# Altium project PIC32ETH.PrjPcb (part 1 of 2)
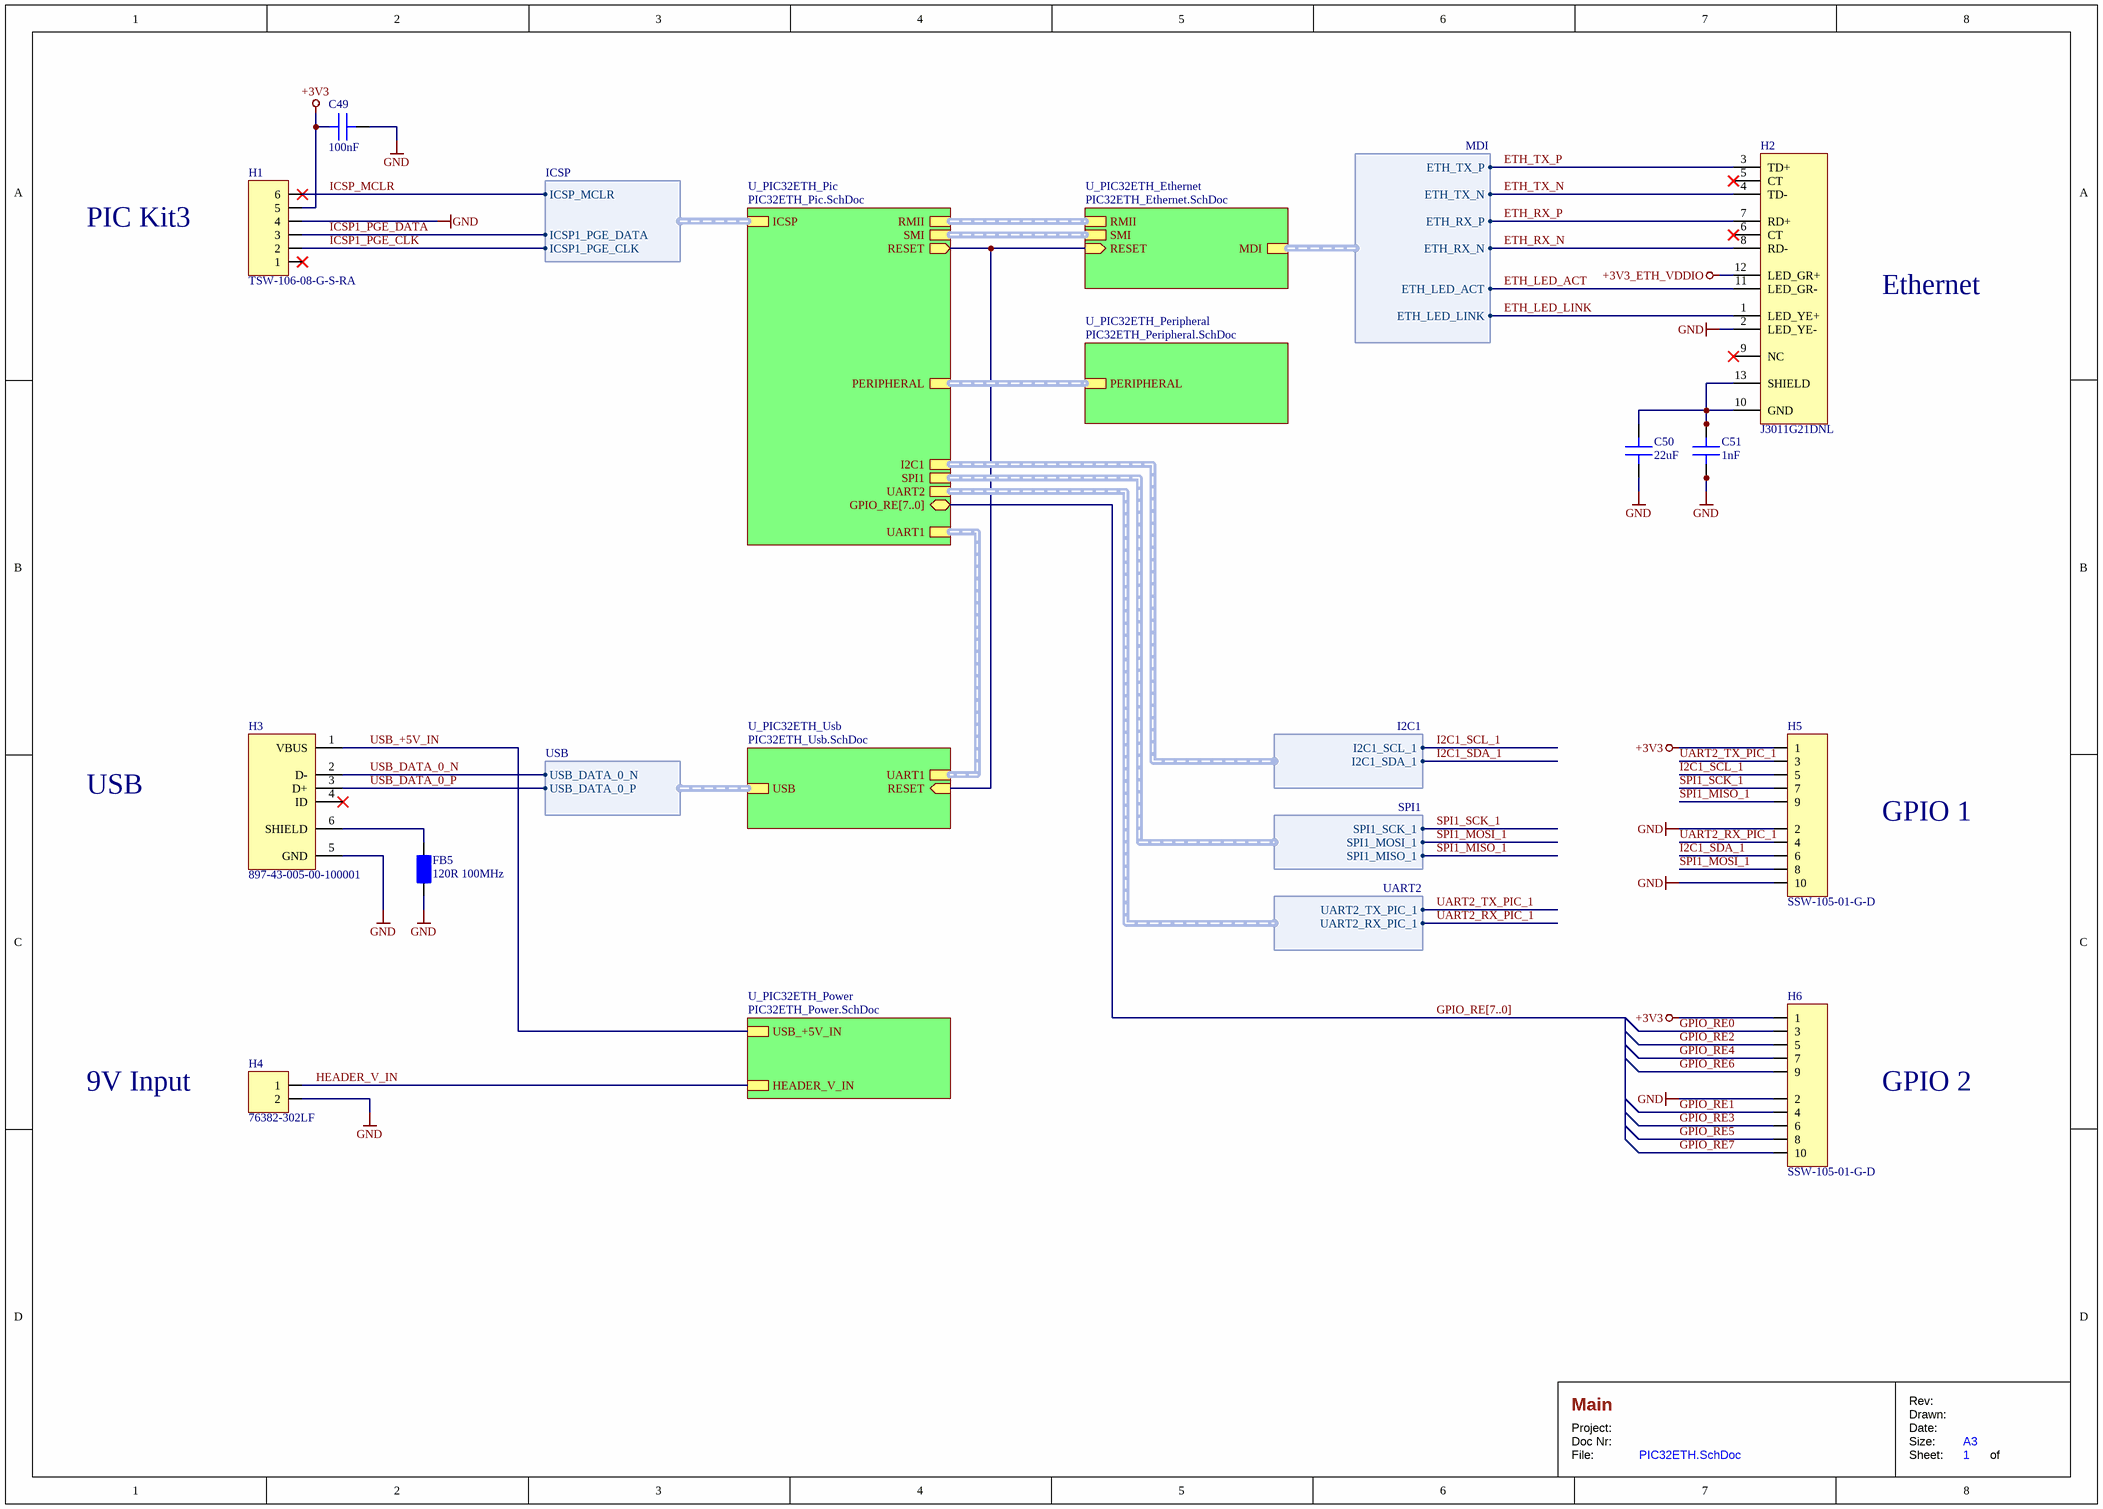
[diagram p0: PIC32ETH.SchDoc]
_Date: 08.01.2022; _DatePcb: 12.03.2022; _DocumentNumber: n/a; _DrawnBy: YS; _Project: PIC32ETH; _Revision: v1.0.0; _SheetTotal: 6
6 sheets, 161 parts. Net scope: hierarchical (ports join the sheet entries above them; power ports are global).
Board file: PIC32ETH.PcbDoc
Sheets:
  PIC32ETH.SchDoc
    U_PIC32ETH_Pic = PIC32ETH_Pic.SchDoc
    U_PIC32ETH_Ethernet = PIC32ETH_Ethernet.SchDoc
    U_PIC32ETH_Peripheral = PIC32ETH_Peripheral.SchDoc
    U_PIC32ETH_Power = PIC32ETH_Power.SchDoc
    U_PIC32ETH_Usb = PIC32ETH_Usb.SchDoc

## Sheet PIC32ETH.SchDoc: Main
size A3; Date: 08.01.2022; DrawnBy: YS; DocumentNumber: n/a; Revision: v1.0.0; SheetNumber: 1; SheetTotal: 6; Project: PIC32ETH

### Parts
C49  100nF  [C_CHIP2012N]
C50  22uF  [C_CHIP3216N]
C51  1nF  [C_CHIP2012N]
FB5  120R 100MHz  [FB_CHIP3216N]
H1  TSW-106-08-G-S-RA  [H_TSW-106-08-G-S-RA]
H2  J3011G21DNL  [H_J3011G21DNL]
H3  897-43-005-00-100001  [H_897-43-005-00-100001]
H4  76382-302LF  [H_76382-302LF]
H5  SSW-105-01-G-D  [H_SSW-105-01-G-D]
H6  SSW-105-01-G-D  [H_SSW-105-01-G-D]

### Sub-sheets
U_PIC32ETH_Ethernet = PIC32ETH_Ethernet.SchDoc: MDI (harness MDI), RMII (harness RMII), SMI (harness SMI), RESET (in)
U_PIC32ETH_Peripheral = PIC32ETH_Peripheral.SchDoc: PERIPHERAL (harness PERIPHERAL)
U_PIC32ETH_Pic = PIC32ETH_Pic.SchDoc: RMII (harness RMII), I2C1 (harness I2C1), UART2 (harness UART2), PERIPHERAL (harness PERIPHERAL), ICSP (harness ICSP), SPI1 (harness SPI1), UART1 (harness UART1), SMI (harness SMI), GPIO_RE[7..0] (bidir), RESET (out)
U_PIC32ETH_Power = PIC32ETH_Power.SchDoc: USB_+5V_IN, HEADER_V_IN
U_PIC32ETH_Usb = PIC32ETH_Usb.SchDoc: UART1 (harness UART1), USB (harness USB), RESET (in)

### Harnesses
MDI: ETH_TX_N, ETH_TX_P, ETH_RX_N, ETH_RX_P, ETH_LED_LINK, ETH_LED_ACT
UART2: UART2_RX_PIC_1, UART2_TX_PIC_1
SPI1: SPI1_MOSI_1, SPI1_SCK_1, SPI1_MISO_1
I2C1: I2C1_SDA_1, I2C1_SCL_1
ICSP: ICSP_MCLR, ICSP1_PGE_DATA, ICSP1_PGE_CLK
USB: USB_DATA_0_P, USB_DATA_0_N

### Nets
+3V3: C49.1 H1.5 H5.1 H6.1
+3V3_ETH_VDDIO: H2.12(LED_GR+)
GND: C49.2 C50.1 C51.1 FB5.2 H1.4 H2.2(LED_YE-) H3.5(GND) H4.2 H5.2 H5.10 H6.2
ETH_LED_ACT: H2.11(LED_GR-) ; sheet U_PIC32ETH_Ethernet/MDI.ETH_LED_ACT
ETH_LED_LINK: H2.1(LED_YE+) ; sheet U_PIC32ETH_Ethernet/MDI.ETH_LED_LINK
ETH_RX_N: H2.8(RD-) ; sheet U_PIC32ETH_Ethernet/MDI.ETH_RX_N
ETH_RX_P: H2.7(RD+) ; sheet U_PIC32ETH_Ethernet/MDI.ETH_RX_P
ETH_TX_N: H2.4(TD-) ; sheet U_PIC32ETH_Ethernet/MDI.ETH_TX_N
ETH_TX_P: H2.3(TD+) ; sheet U_PIC32ETH_Ethernet/MDI.ETH_TX_P
GPIO_RE0: H6.3
GPIO_RE1: H6.4
GPIO_RE2: H6.5
GPIO_RE3: H6.6
GPIO_RE4: H6.7
GPIO_RE5: H6.8
GPIO_RE6: H6.9
GPIO_RE7: H6.10
HEADER_V_IN: H4.1 ; sheet U_PIC32ETH_Power/HEADER_V_IN
I2C1_SCL_1: H5.5 ; sheet U_PIC32ETH_Pic/I2C1.I2C1_SCL_1
I2C1_SDA_1: H5.6 ; sheet U_PIC32ETH_Pic/I2C1.I2C1_SDA_1
ICSP1_PGE_CLK: H1.2 ; sheet U_PIC32ETH_Pic/ICSP.ICSP1_PGE_CLK
ICSP1_PGE_DATA: H1.3 ; sheet U_PIC32ETH_Pic/ICSP.ICSP1_PGE_DATA
ICSP_MCLR: H1.6 ; sheet U_PIC32ETH_Pic/ICSP.ICSP_MCLR
RESET: sheet U_PIC32ETH_Pic/RESET, sheet U_PIC32ETH_Ethernet/RESET, sheet U_PIC32ETH_Usb/RESET
SPI1_MISO_1: H5.9 ; sheet U_PIC32ETH_Pic/SPI1.SPI1_MISO_1
SPI1_MOSI_1: H5.8 ; sheet U_PIC32ETH_Pic/SPI1.SPI1_MOSI_1
SPI1_SCK_1: H5.7 ; sheet U_PIC32ETH_Pic/SPI1.SPI1_SCK_1
UART2_RX_PIC_1: H5.4 ; sheet U_PIC32ETH_Pic/UART2.UART2_RX_PIC_1
UART2_TX_PIC_1: H5.3 ; sheet U_PIC32ETH_Pic/UART2.UART2_TX_PIC_1
USB_+5V_IN: H3.1(VBUS) ; sheet U_PIC32ETH_Power/USB_+5V_IN
USB_DATA_0_N: H3.2(D-) ; sheet U_PIC32ETH_Usb/USB.USB_DATA_0_N
USB_DATA_0_P: H3.3(D+) ; sheet U_PIC32ETH_Usb/USB.USB_DATA_0_P
NetC50_2: C50.2 C51.2 H2.10(GND) H2.13(SHIELD)
NetFB5_1: FB5.1 H3.6(SHIELD)

Not connected (* = marked no-connect by the designer): H1 1*; H2 5(CT)* 6(CT)* 9(NC)*; H3 4(ID)*

### Buses and harness runs
bus GPIO_RE[7..0] = sheet U_PIC32ETH_Pic/GPIO_RE[7..0]
harness sheet U_PIC32ETH_Ethernet/RMII = sheet U_PIC32ETH_Pic/RMII
harness sheet U_PIC32ETH_Ethernet/SMI = sheet U_PIC32ETH_Pic/SMI
harness sheet U_PIC32ETH_Peripheral/PERIPHERAL = sheet U_PIC32ETH_Pic/PERIPHERAL
harness sheet U_PIC32ETH_Pic/UART1 = sheet U_PIC32ETH_Usb/UART1

### Notes on the sheet
- PIC Kit3
- Ethernet
- USB
- GPIO 1
- 9V Input
- GPIO 2
- Project:
- Doc Nr:
- File:
- Drawn:
- Rev:
- Date:
- Size:
- Sheet:
- A3
- of

### Library data of the parts
C49 = C_C0805C104K5RACTU: C CERAMIC 100nF 50V 10% 2012; Manufacturer: Kemet; Dielectric: X7R; Tolerance: +/-10%; Datasheet Url: https://content.kemet.com/datasheets/KEM_C1002_X7R_SMD.pdf; Mounting: SMT; Package: 2012; Part Number: C0805C104K5RACTU; Price: 0.23; Price Currency: CHF; Supplier 1: Digi-Key; Capacitance: 100nF; Voltage: 50V; Supplier Part Number 1: 399-1170-1-ND; Esr: n/a; Pin Count: 2; Temperature Range: -55degC to 125degC
C50 = C_C1206C226K8RAC7800: C CERAMIC 22uF 10V 10% 3216; Manufacturer: Kemet; Dielectric: X7R; Tolerance: +/-10%; Package: 3216; Supplier 1: Digi-Key; Part Number: C1206C226K8RAC7800; Temperature Range: -55degC to 125degC; Datasheet Url: https://api.kemet.com/component-edge/download/datasheet/C1206C226K8RAC7800.pdf; Mounting: SMT; Price: 0.65; Price Currency: CHF; Note: *; Capacitance: 22uF; Voltage: 10V; Pin Count: 2; Esr: n/a; Supplier Part Number 1: 399-11947-1-ND
C51 = C_C0805C102K5RACTU: C CERAMIC 1nF 50V 10% 2012; Manufacturer: Kemet; Dielectric: X7R; Tolerance: +/-10%; Datasheet Url: https://content.kemet.com/datasheets/KEM_C1002_X7R_SMD.pdf; Mounting: SMT; Package: 2012; Part Number: C0805C102K5RACTU; Price: 0.11; Price Currency: CHF; Supplier 1: Digi-Key; Capacitance: 1nF; Voltage: 50V; Supplier Part Number 1: 399-1147-1-ND; Esr: n/a; Pin Count: 2; Temperature Range: -55degC to 125degC
FB5 = FB_BLM31KN121SN1L: FB 120R 100MHz 6A 3216; Manufacturer: Murata Electronics; Resistance: 9mR; Datasheet Url: https://www.murata.com/en-us/products/productdata/8801529331742/ENFA0091.pdf; Mounting: SMT; Package: 3216; Part Number: BLM31KN121SN1L; Price: 0.29; Price Currency: CHF; Supplier 1: Digi-Key; Supplier Part Number 1: 490-16524-1-ND; Temperature Range: -55degC to 125degC; Pin Count: 2; Current: 6A; Impedance: 120R 100MHz
H1 = H_TSW-106-08-G-S-RA: H GENERAL HEADER 6POS 1ROW 2.54mm ANGLE THT; Manufacturer: Samtec Inc.; Current: 5.7A; Voltage: 550VAC, 770VDC; Positions: 6; Rows: 1; Datasheet URL: http://suddendocs.samtec.com/catalog_english/tsw_th.pdf; Mounting: THT; Package: n/a; Part Number: TSW-106-08-G-S-RA; Price: 0.68; Price Currency: CHF; Supplier 1: Digi-Key; Supplier Part Number 1: SAM1039-06-ND; Temperature Range: -55degC to 125degC; Pin Count: 6; Mating Cycles: n/a; Header Type: Header; Orientation: Angle; Spacing: 2.54mm
H2 = H_J3011G21DNL: H RJ45 SOCKET 1PORT ANGLE SMT; Manufacturer: Pulse; Ports: 1; Part Number: J3011G21DNL; Price Currency: CHF; Current: n/a; Datasheet URL: https://productfinder.pulseeng.com/doc_type/WEB301/doc_num/J409/doc_part/J409.pdf; Mating Cycles: n/a; Mounting: SMT; Package: n/a; Pin Count: 13; Price: 8.68; Temperature Range: 0°C to 70°C; Voltage: n/a; Header Type: Socket; Orientation: Angle; Supplier 1: Digi-Key; Supplier Part Number 1: 553-1491-ND
H3 = H_897-43-005-00-100001: H USB SOCKET 1PORT B-MINI ANGLE SMT; Manufacturer: Mill-Max Manufacturing Corp.; Mating Cycles: 5000; Current: 1A; Voltage: 30VAC; Ports: 1; Datasheet URL: http://www.farnell.com/datasheets/1734713.pdf?_ga=2.223747291.1932968036.1561574157-1154557334.1561574157&_gac=1.227804655.1561574157.CjwKCAjwr8zoBRA0EiwANmvpYNQHn877f_ACzLNOCpO9cVZHUYePGKu6J6mtcTAYQ9aGUVPIBV0ilRoC6_EQAvD_BwE; Mounting: SMT; Package: n/a; Part Number: 897-43-005-00-100001; Price: 1.21; Price Currency: CHF; Supplier 1: Digi-Key; Supplier Part Number 1: ED90341CT-ND; Pin Count: 6; Temperature Range: n/a; Header Type: Socket; Orientation: Angle; Usb Type: B-Mini
H4 = H_76382-302LF: H GENERAL HEADER 2POS 1ROW 2.54mm ANGLE THT; Manufacturer: Amphenol ICC; Current: 3A; Mating Cycles: 1000; Voltage: 1000V; Positions: 2; Rows: 1; Datasheet URL: https://cdn.amphenol-icc.com/media/wysiwyg/files/drawing/76382.pdf; Mounting: THT; Package: n/a; Part Number: 76382-302LF; Price: 0.71; Price Currency: CHF; Supplier 1: Digi-Key; Supplier Part Number 1: 609-1278-ND; Pin Count: 2; Temperature Range: -40degC to 125degC; Header Type: Header; Orientation: Angle; Spacing: 2.54mm
H5 H6 = H_SSW-105-01-G-D: H GENERAL SOCKET 10POS 2ROW 2.54mm VERTICAL THT; Manufacturer: Samtec Inc.; Current: 5.7A; Voltage: 465VAC, 655VDC; Positions: 10; Rows: 2; Datasheet URL: http://suddendocs.samtec.com/catalog_english/ssq_th.pdf; Mounting: THT; Package: n/a; Part Number: SSW-105-01-G-D; Price: 1.33; Price Currency: CHF; Supplier 1: Digi-Key; Supplier Part Number 1: SAM1208-05-ND; Temperature Range: -55degC to 125degC; Pin Count: 10; Mating Cycles: n/a; Header Type: Socket; Orientation: Vertical; Spacing: 2.54mm

## Sheet PIC32ETH_Pic.SchDoc: Pic
size A2; Date: 08.01.2022; DrawnBy: YS; DocumentNumber: n/a; Revision: v1.0.0; SheetNumber: 2; SheetTotal: 6; Project: PIC32ETH
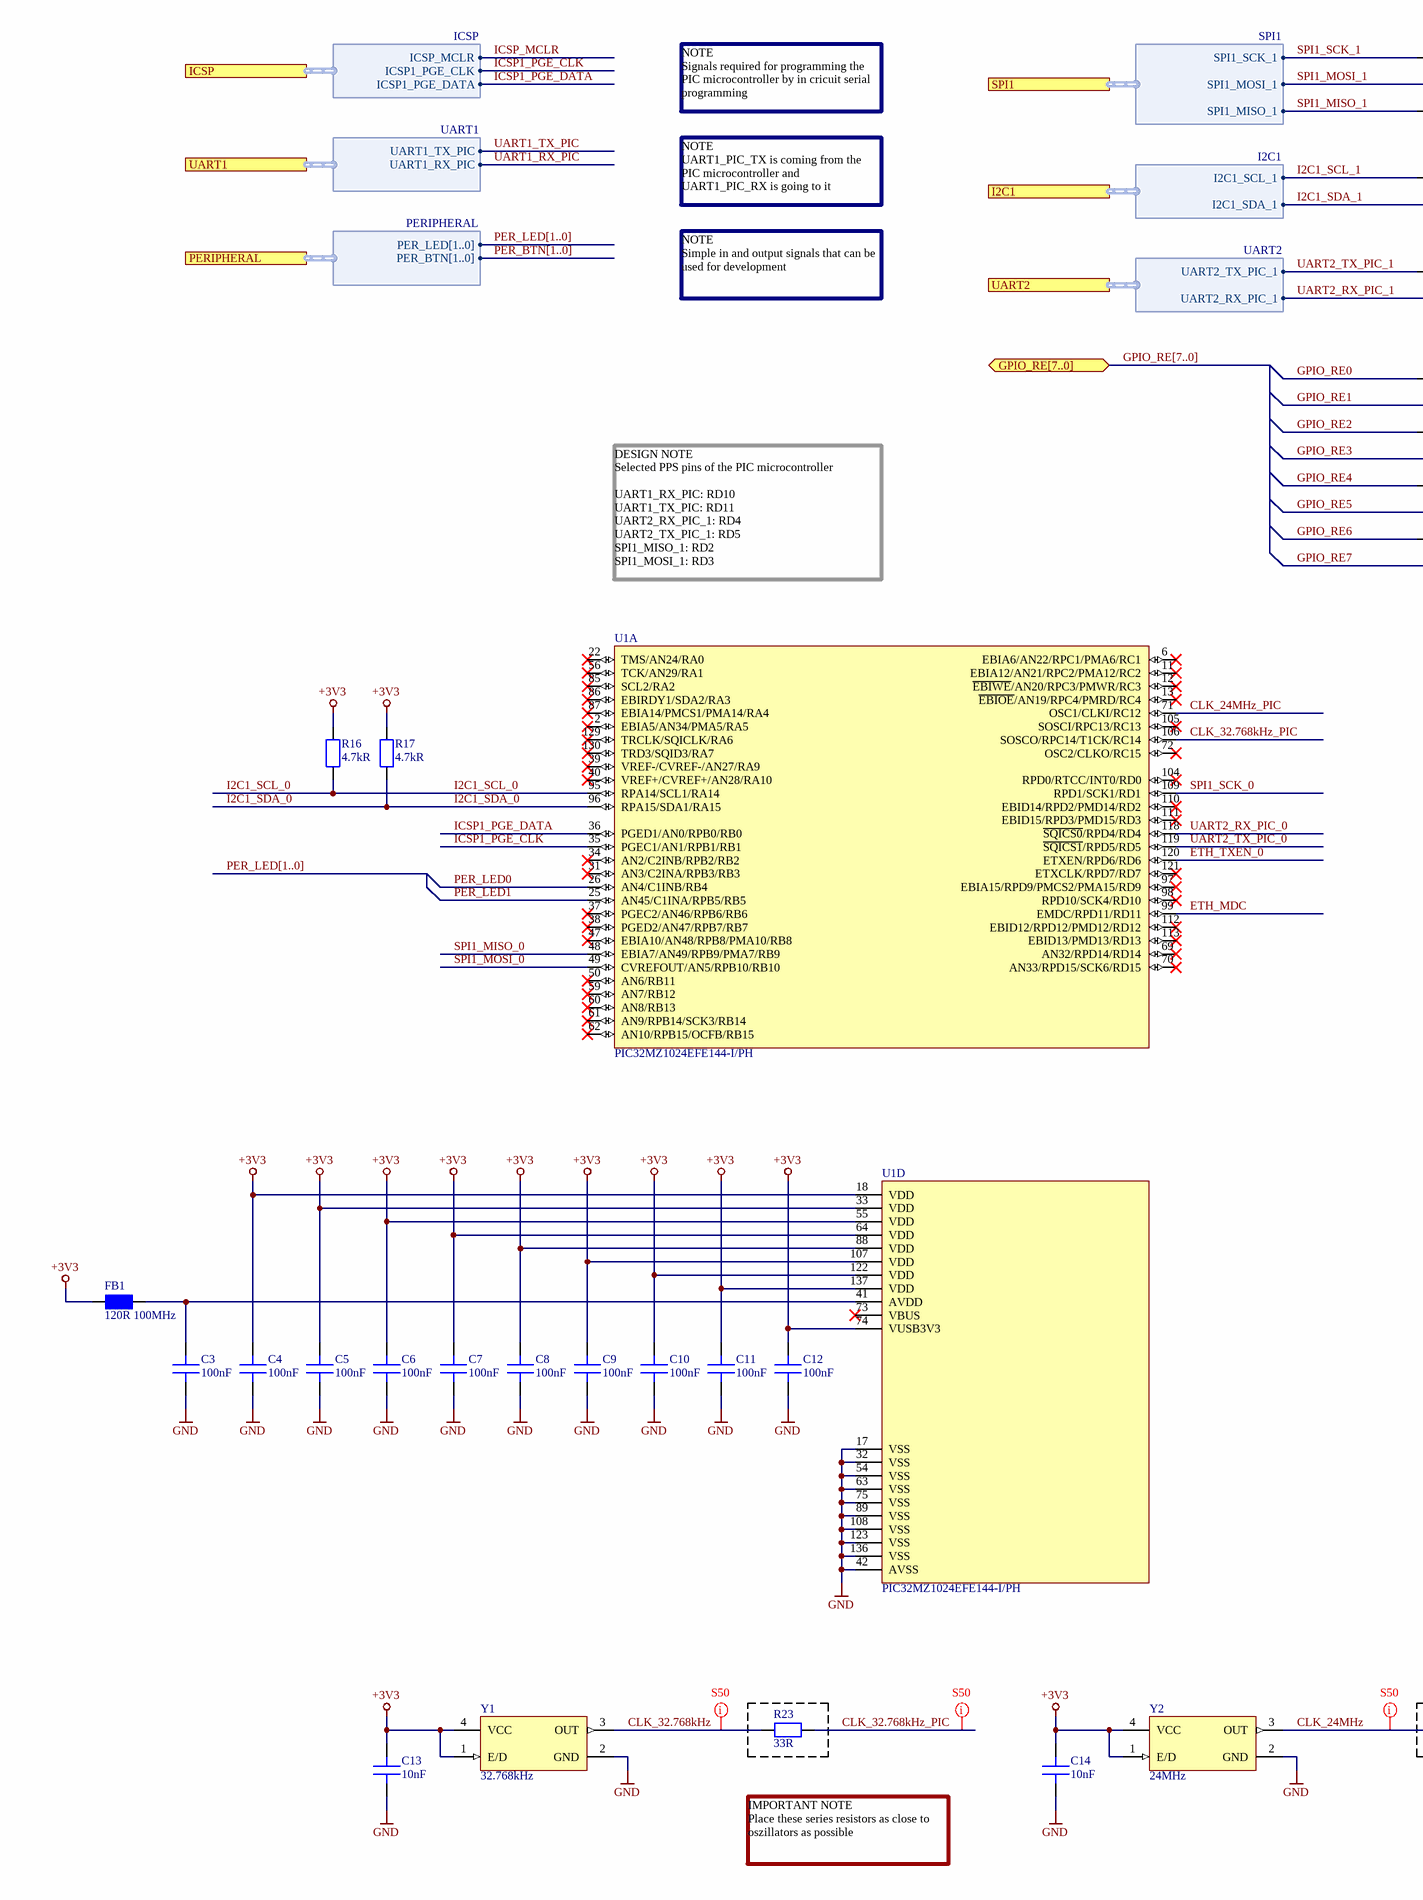
[diagram p1: PIC32ETH_Pic.SchDoc, left]
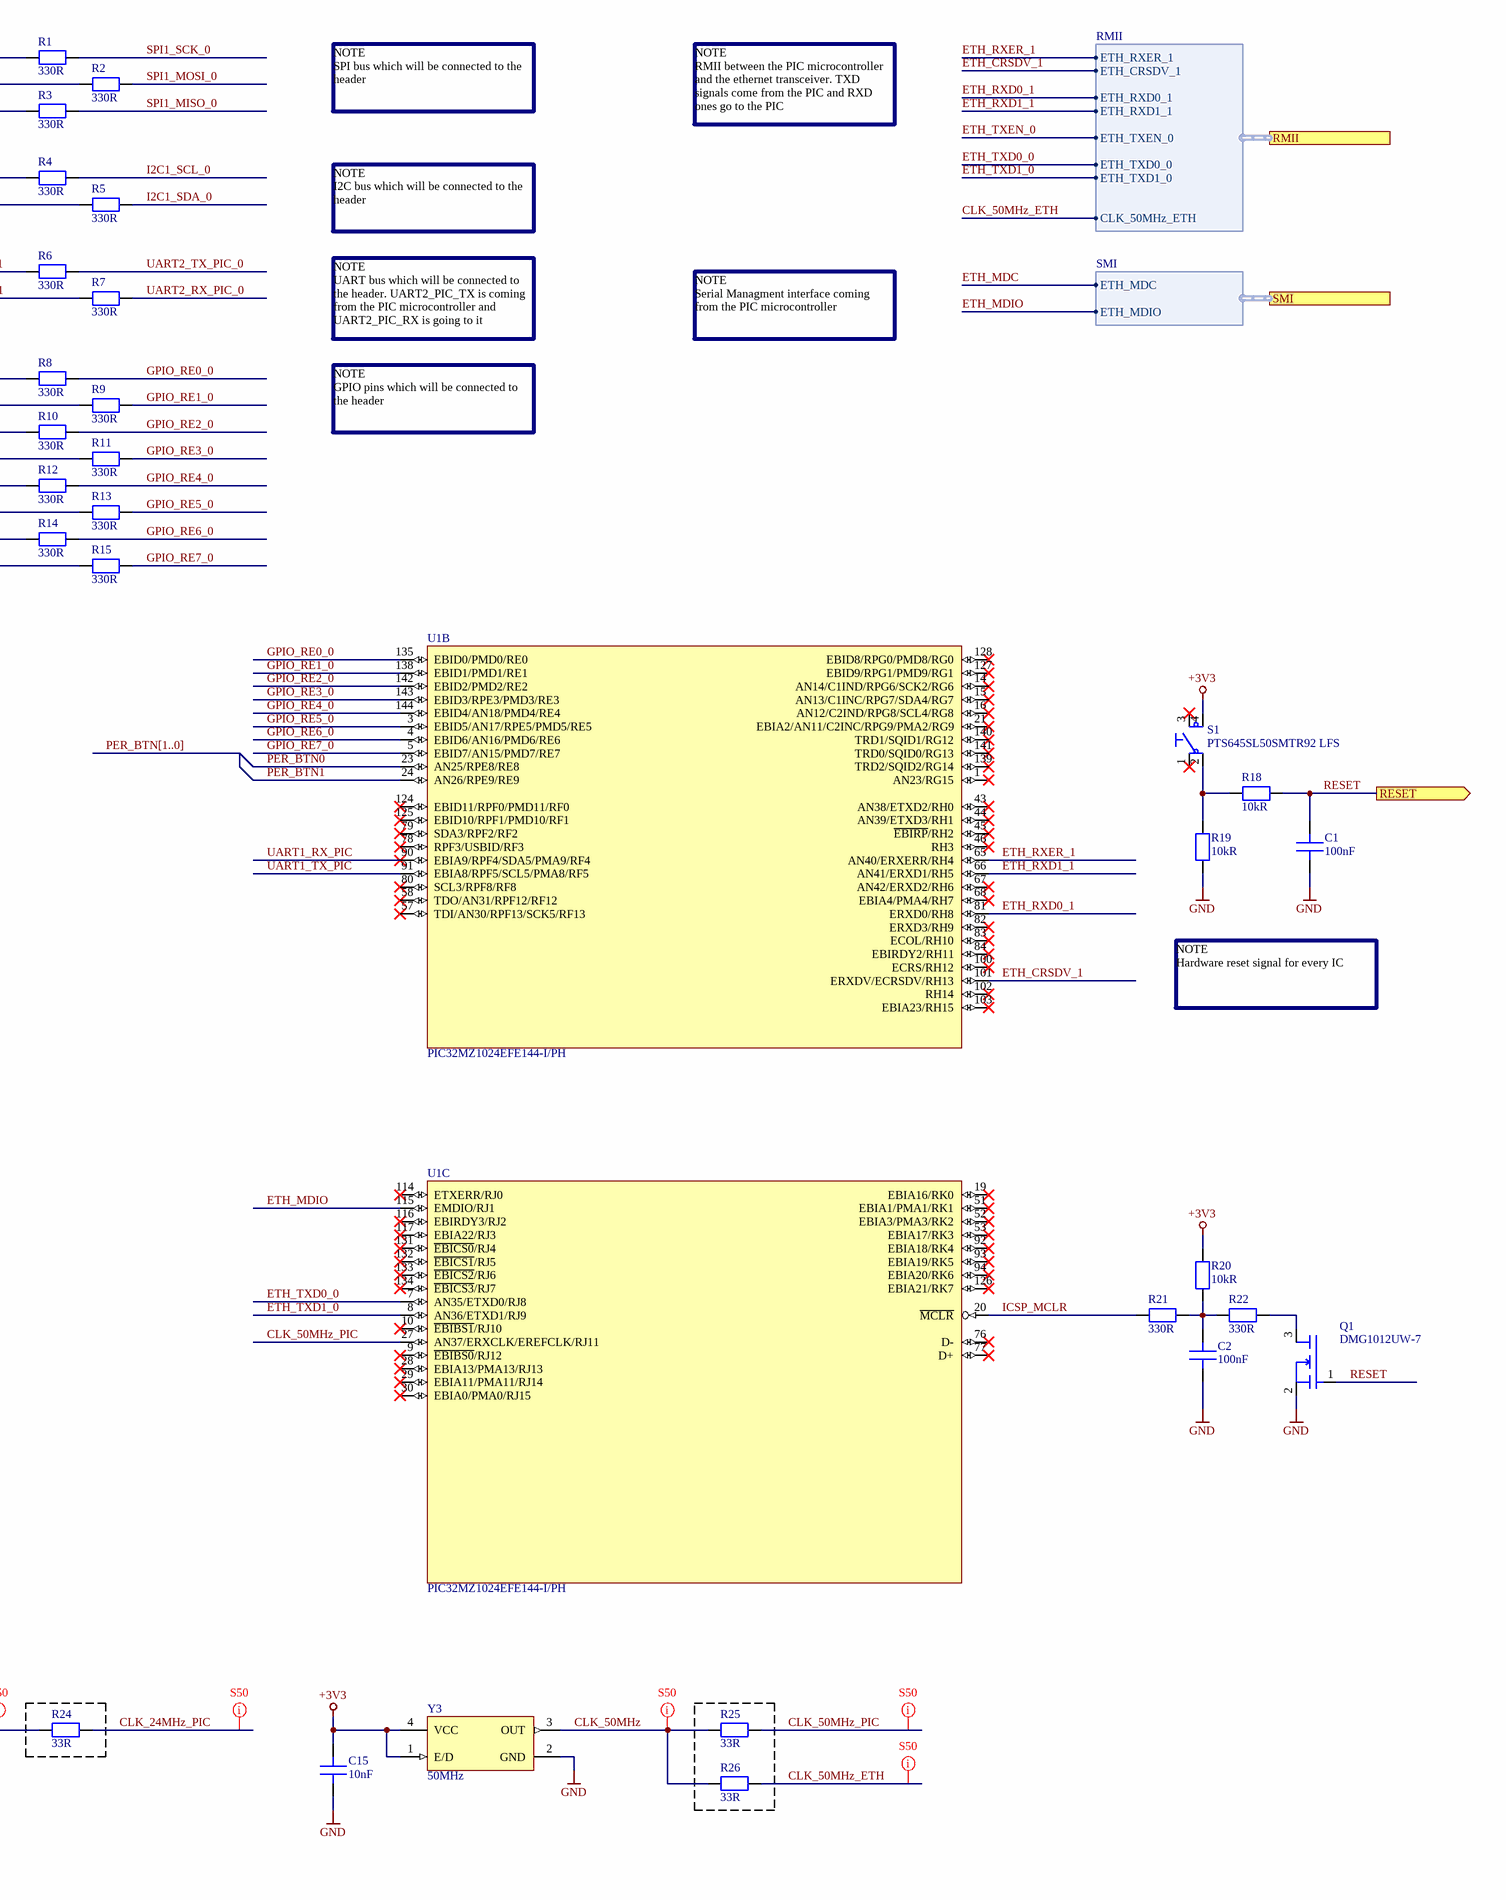
[diagram p2: PIC32ETH_Pic.SchDoc, right]

### Parts
C1  100nF  [C_CHIP2012N]
C2  100nF  [C_CHIP2012N]
C3  100nF  [C_CHIP2012N]
C4  100nF  [C_CHIP2012N]
C5  100nF  [C_CHIP2012N]
C6  100nF  [C_CHIP2012N]
C7  100nF  [C_CHIP2012N]
C8  100nF  [C_CHIP2012N]
C9  100nF  [C_CHIP2012N]
C10  100nF  [C_CHIP2012N]
C11  100nF  [C_CHIP2012N]
C12  100nF  [C_CHIP2012N]
C13  10nF  [C_CHIP2012N]
C14  10nF  [C_CHIP2012N]
C15  10nF  [C_CHIP2012N]
FB1  120R 100MHz  [FB_CHIP3216N]
Q1  DMG1012UW-7  [Q_SOT65P210X100-3N]
R1  330R  [R_CHIP2012N]
R2  330R  [R_CHIP2012N]
R3  330R  [R_CHIP2012N]
R4  330R  [R_CHIP2012N]
R5  330R  [R_CHIP2012N]
R6  330R  [R_CHIP2012N]
R7  330R  [R_CHIP2012N]
R8  330R  [R_CHIP2012N]
R9  330R  [R_CHIP2012N]
R10  330R  [R_CHIP2012N]
R11  330R  [R_CHIP2012N]
R12  330R  [R_CHIP2012N]
R13  330R  [R_CHIP2012N]
R14  330R  [R_CHIP2012N]
R15  330R  [R_CHIP2012N]
R16  4.7kR  [R_CHIP2012N]
R17  4.7kR  [R_CHIP2012N]
R18  10kR  [R_CHIP2012N]
R19  10kR  [R_CHIP2012N]
R20  10kR  [R_CHIP2012N]
R21  330R  [R_CHIP2012N]
R22  330R  [R_CHIP2012N]
R23  33R  [R_CHIP2012N]
R24  33R  [R_CHIP2012N]
R25  33R  [R_CHIP2012N]
R26  33R  [R_CHIP2012N]
S1  PTS645SL50SMTR92 LFS  [S_CHIPP620X620-4N]
U1  PIC32MZ1024EFE144-I/PH  [U_QFP40P1800X1800X120-144N]  (parts A,B,C,D of 4)
Y1  32.768kHz  [Y_CHIPP320X250-4N]
Y2  24MHz  [Y_CHIPP320X250-4N]
Y3  50MHz  [Y_CHIPP320X250-4N]

### Ports
GPIO_RE[7..0] (bidir), I2C1 (harness I2C1), ICSP (harness ICSP), PERIPHERAL (harness PERIPHERAL), RESET (out), RMII (harness RMII), SMI (harness SMI), SPI1 (harness SPI1), UART1 (harness UART1), UART2 (harness UART2)

### Harnesses
ICSP: ICSP_MCLR, ICSP1_PGE_DATA, ICSP1_PGE_CLK
UART1: UART1_RX_PIC, UART1_TX_PIC
UART2: UART2_RX_PIC_1, UART2_TX_PIC_1
SPI1: SPI1_MOSI_1, SPI1_SCK_1, SPI1_MISO_1
I2C1: I2C1_SDA_1, I2C1_SCL_1
PERIPHERAL: PER_BTN[1..0], PER_LED[1..0]
RMII: CLK_50MHz_ETH, ETH_RXER_1, ETH_TXEN_0, ETH_CRSDV_1, ETH_RXD0_1, ETH_RXD1_1, ETH_TXD1_0, ETH_TXD0_0
SMI: ETH_MDIO, ETH_MDC

### Nets
+3V3: C4.1 C5.1 C6.1 C7.1 C8.1 C9.1 C10.1 C11.1 C12.1 C13.2 C14.2 C15.2 FB1.1 R16.2 R17.2 R20.2 S1.4 U1.18(VDD) U1.33(VDD) U1.55(VDD) U1.64(VDD) U1.74(VUSB3V3) U1.88(VDD) U1.107(VDD) U1.122(VDD) U1.137(VDD) Y1.1(E/D) Y1.4(VCC) Y2.1(E/D) Y2.4(VCC) Y3.1(E/D) Y3.4(VCC)
GND: C1.2 C2.2 C3.2 C4.2 C5.2 C6.2 C7.2 C8.2 C9.2 C10.2 C11.2 C12.2 C13.1 C14.1 C15.1 Q1.2(S) R19.1 U1.17(VSS) U1.32(VSS) U1.42(AVSS) U1.54(VSS) U1.63(VSS) U1.75(VSS) U1.89(VSS) U1.108(VSS) U1.123(VSS) U1.136(VSS) Y1.2(GND) Y2.2(GND) Y3.2(GND)
CLK_24MHz: R24.1 Y2.3(OUT)
CLK_24MHz_PIC: R24.2 U1.71(OSC1/CLKI/RC12)
CLK_32.768kHz: R23.1 Y1.3(OUT)
CLK_32.768kHz_PIC: R23.2 U1.106(SOSCO/RPC14/T1CK/RC14)
CLK_50MHz: R25.1 R26.1 Y3.3(OUT)
CLK_50MHz_ETH: R26.2 ; port RMII.CLK_50MHz_ETH
CLK_50MHz_PIC: R25.2 U1.27(AN37/ERXCLK/EREFCLK/RJ11)
ETH_CRSDV_1: U1.101(ERXDV/ECRSDV/RH13) ; port RMII.ETH_CRSDV_1
ETH_MDC: U1.99(EMDC/RPD11/RD11) ; port SMI.ETH_MDC
ETH_MDIO: U1.115(EMDIO/RJ1) ; port SMI.ETH_MDIO
ETH_RXD0_1: U1.81(ERXD0/RH8) ; port RMII.ETH_RXD0_1
ETH_RXD1_1: U1.66(AN41/ERXD1/RH5) ; port RMII.ETH_RXD1_1
ETH_RXER_1: U1.65(AN40/ERXERR/RH4) ; port RMII.ETH_RXER_1
ETH_TXD0_0: U1.7(AN35/ETXD0/RJ8) ; port RMII.ETH_TXD0_0
ETH_TXD1_0: U1.8(AN36/ETXD1/RJ9) ; port RMII.ETH_TXD1_0
ETH_TXEN_0: U1.120(ETXEN/RPD6/RD6) ; port RMII.ETH_TXEN_0
GPIO_RE0: R8.1
GPIO_RE0_0: R8.2 U1.135(EBID0/PMD0/RE0)
GPIO_RE1: R9.1
GPIO_RE1_0: R9.2 U1.138(EBID1/PMD1/RE1)
GPIO_RE2: R10.1
GPIO_RE2_0: R10.2 U1.142(EBID2/PMD2/RE2)
GPIO_RE3: R11.1
GPIO_RE3_0: R11.2 U1.143(EBID3/RPE3/PMD3/RE3)
GPIO_RE4: R12.1
GPIO_RE4_0: R12.2 U1.144(EBID4/AN18/PMD4/RE4)
GPIO_RE5: R13.1
GPIO_RE5_0: R13.2 U1.3(EBID5/AN17/RPE5/PMD5/RE5)
GPIO_RE6: R14.1
GPIO_RE6_0: R14.2 U1.4(EBID6/AN16/PMD6/RE6)
GPIO_RE7: R15.1
GPIO_RE7_0: R15.2 U1.5(EBID7/AN15/PMD7/RE7)
I2C1_SCL_0: R4.2 R16.1 U1.95(RPA14/SCL1/RA14)
I2C1_SCL_1: R4.1 ; port I2C1.I2C1_SCL_1
I2C1_SDA_0: R5.2 R17.1 U1.96(RPA15/SDA1/RA15)
I2C1_SDA_1: R5.1 ; port I2C1.I2C1_SDA_1
ICSP1_PGE_CLK: U1.35(PGEC1/AN1/RPB1/RB1) ; port ICSP.ICSP1_PGE_CLK
ICSP1_PGE_DATA: U1.36(PGED1/AN0/RPB0/RB0) ; port ICSP.ICSP1_PGE_DATA
ICSP_MCLR: R21.1 U1.20(~{MCLR}) ; port ICSP.ICSP_MCLR
PER_BTN0: U1.23(AN25/RPE8/RE8)
PER_BTN1: U1.24(AN26/RPE9/RE9)
PER_LED0: U1.26(AN4/C1INB/RB4)
PER_LED1: U1.25(AN45/C1INA/RPB5/RB5)
RESET: C1.1 Q1.1(G) R18.1 ; port RESET
SPI1_MISO_0: R3.2 U1.48(EBIA7/AN49/RPB9/PMA7/RB9)
SPI1_MISO_1: R3.1 ; port SPI1.SPI1_MISO_1
SPI1_MOSI_0: R2.2 U1.49(CVREFOUT/AN5/RPB10/RB10)
SPI1_MOSI_1: R2.1 ; port SPI1.SPI1_MOSI_1
SPI1_SCK_0: R1.2 U1.109(RPD1/SCK1/RD1)
SPI1_SCK_1: R1.1 ; port SPI1.SPI1_SCK_1
UART1_RX_PIC: U1.90(EBIA9/RPF4/SDA5/PMA9/RF4) ; port UART1.UART1_RX_PIC
UART1_TX_PIC: U1.91(EBIA8/RPF5/SCL5/PMA8/RF5) ; port UART1.UART1_TX_PIC
UART2_RX_PIC_0: R7.2 U1.118(~{SQICS0}/RPD4/RD4)
UART2_RX_PIC_1: R7.1 ; port UART2.UART2_RX_PIC_1
UART2_TX_PIC_0: R6.2 U1.119(~{SQICS1}/RPD5/RD5)
UART2_TX_PIC_1: R6.1 ; port UART2.UART2_TX_PIC_1
NetC2_1: C2.1 R20.1 R21.2 R22.1
NetC3_1: C3.1 FB1.2 U1.41(AVDD)
NetQ1_3: Q1.3(D) R22.2
NetR18_2: R18.2 R19.2 S1.2

Not connected (* = marked no-connect by the designer): S1 1* 3*; U1 1(AN23/RG15)* 2(EBIA5/AN34/PMA5/RA5)* 6(EBIA6/AN22/RPC1/PMA6/RC1)* 9(~{EBIBS0}/RJ12)* 10(~{EBIBS1}/RJ10)* 11(EBIA12/AN21/RPC2/PMA12/RC2)* 12(~{EBIWE}/AN20/RPC3/PMWR/RC3)* 13(~{EBIOE}/AN19/RPC4/PMRD/RC4)* 14(AN14/C1IND/RPG6/SCK2/RG6)* 15(AN13/C1INC/RPG7/SDA4/RG7)* 16(AN12/C2IND/RPG8/SCL4/RG8)* 19(EBIA16/RK0)* 21(EBIA2/AN11/C2INC/RPG9/PMA2/RG9)* 22(TMS/AN24/RA0)* 28(EBIA13/PMA13/RJ13)* 29(EBIA11/PMA11/RJ14)* 30(EBIA0/PMA0/RJ15)* 31(AN3/C2INA/RPB3/RB3)* 34(AN2/C2INB/RPB2/RB2)* 37(PGEC2/AN46/RPB6/RB6)* 38(PGED2/AN47/RPB7/RB7)* 39(VREF-/CVREF-/AN27/RA9)* 40(VREF+/CVREF+/AN28/RA10)* 43(AN38/ETXD2/RH0)* 44(AN39/ETXD3/RH1)* 45(~{EBIRP}/RH2)* 46(RH3)* 47(EBIA10/AN48/RPB8/PMA10/RB8)* 50(AN6/RB11)* 51(EBIA1/PMA1/RK1)* 52(EBIA3/PMA3/RK2)* 53(EBIA17/RK3)* 56(TCK/AN29/RA1)* 57(TDI/AN30/RPF13/SCK5/RF13)* 58(TDO/AN31/RPF12/RF12)* 59(AN7/RB12)* 60(AN8/RB13)* 61(AN9/RPB14/SCK3/RB14)* 62(AN10/RPB15/OCFB/RB15)* 67(AN42/ERXD2/RH6)* 68(EBIA4/PMA4/RH7)* 69(AN32/RPD14/RD14)* 70(AN33/RPD15/SCK6/RD15)* 72(OSC2/CLKO/RC15)* 73(VBUS)* 76(D-)* 77(D+)* 78(RPF3/USBID/RF3)* 79(SDA3/RPF2/RF2)* 80(SCL3/RPF8/RF8)* 82(ERXD3/RH9)* 83(ECOL/RH10)* 84(EBIRDY2/RH11)* 85(SCL2/RA2)* 86(EBIRDY1/SDA2/RA3)* 87(EBIA14/PMCS1/PMA14/RA4)* 92(EBIA18/RK4)* 93(EBIA19/RK5)* 94(EBIA20/RK6)* 97(EBIA15/RPD9/PMCS2/PMA15/RD9)* 98(RPD10/SCK4/RD10)* 100(ECRS/RH12)* 102(RH14)* 103(EBIA23/RH15)* 104(RPD0/RTCC/INT0/RD0)* 105(SOSCI/RPC13/RC13)* 110(EBID14/RPD2/PMD14/RD2)* 111(EBID15/RPD3/PMD15/RD3)* 112(EBID12/RPD12/PMD12/RD12)* 113(EBID13/PMD13/RD13)* 114(ETXERR/RJ0)* 116(EBIRDY3/RJ2)* 117(EBIA22/RJ3)* 121(ETXCLK/RPD7/RD7)* 124(EBID11/RPF0/PMD11/RF0)* 125(EBID10/RPF1/PMD10/RF1)* 126(EBIA21/RK7)* 127(EBID9/RPG1/PMD9/RG1)* 128(EBID8/RPG0/PMD8/RG0)* 129(TRCLK/SQICLK/RA6)* 130(TRD3/SQID3/RA7)* 131(~{EBICS0}/RJ4)* 132(~{EBICS1}/RJ5)* 133(~{EBICS2}/RJ6)* 134(~{EBICS3}/RJ7)* 139(TRD2/SQID2/RG14)* 140(TRD1/SQID1/RG12)* 141(TRD0/SQID0/RG13)*

### Buses and harness runs
bus GPIO_RE[7..0] = port GPIO_RE[7..0]
bus PER_BTN[1..0]
bus PER_LED[1..0]

### Layout directives
net class IMPEDANCE_S50: CLK_24MHz, CLK_24MHz_PIC, CLK_32.768kHz, CLK_32.768kHz_PIC, CLK_50MHz, CLK_50MHz_ETH, CLK_50MHz_PIC

### Notes on the sheet
- NOTE
  Signals required for programming the PIC microcontroller by in cricuit serial programming
- NOTE
  SPI bus which will be connected to the header
- NOTE
  RMII between the PIC microcontroller and the ethernet transceiver. TXD signals come from the PIC and RXD ones go to the PIC
- NOTE
  UART1_PIC_TX is coming from the PIC microcontroller and UART1_PIC_RX is going to it
- NOTE
  I2C bus which will be connected to the header
- NOTE
  Simple in and output signals that can be used for development
- NOTE
  UART bus which will be connected to the header. UART2_PIC_TX is coming from the PIC microcontroller and UART2_PIC_RX is going to it
- NOTE
  Serial Managment interface coming from the PIC microcontroller
- NOTE
  GPIO pins which will be connected to the header
- DESIGN NOTE
  Selected PPS pins of the PIC microcontroller
  UART1_RX_PIC: RD10
  UART1_TX_PIC: RD11
  UART2_RX_PIC_1: RD4
  UART2_TX_PIC_1: RD5
  SPI1_MISO_1: RD2
  SPI1_MOSI_1: RD3
- NOTE
  Hardware reset signal for every IC
- IMPORTANT NOTE
  Place these series resistors as close to oszillators as possible
- Rev:
- Project:
- Doc Nr:
- File:
- Drawn:
- Date:
- Size:
- Sheet:
- A2
- of

### Library data of the parts
C1-C12 = C_C0805C104K5RACTU: as C49 on sheet PIC32ETH; Datasheet Url: https://content.kemet.com/datasheets/KEM_C1002_X7R_SMD.pdf; Mounting: SMT; Package: 2012; Part Number: C0805C104K5RACTU; Price: 0.23; Price Currency: CHF; Supplier 1: Digi-Key; Capacitance: 100nF; Voltage: 50V; Supplier Part Number 1: 399-1170-1-ND; Esr: n/a; Pin Count: 2; Temperature Range: -55degC to 125degC
C13-C15 = C_C0805C103K5RACTU: C CERAMIC 10nF 50V 10% 2012; Manufacturer: Kemet; Dielectric: X7R; Tolerance: +/-10%; Datasheet Url: https://content.kemet.com/datasheets/KEM_C1002_X7R_SMD.pdf; Mounting: SMT; Package: 2012; Part Number: C0805C103K5RACTU; Price: 0.18; Price Currency: CHF; Supplier 1: Digi-Key; Capacitance: 10nF; Voltage: 50V; Supplier Part Number 1: 399-1158-1-ND; Esr: n/a; Pin Count: 2; Temperature Range: -55degC to 125degC
FB1 = FB_BLM31KN121SN1L: as FB5 on sheet PIC32ETH; Datasheet Url: https://www.murata.com/en-us/products/productdata/8801529331742/ENFA0091.pdf; Mounting: SMT; Package: 3216; Part Number: BLM31KN121SN1L; Price: 0.29; Price Currency: CHF; Supplier 1: Digi-Key; Supplier Part Number 1: 490-16524-1-ND; Temperature Range: -55degC to 125degC; Pin Count: 2; Current: 6A; Impedance: 120R 100MHz
Q1 = Q_DMG1012UW-7: Q MOSFET N-CH 20V 1A SOT-323; Manufacturer: Diodes Incorporated; Power: 290mW; Voltage Gate Source: +/-6V; Datasheet Url: https://www.diodes.com/assets/Datasheets/ds31859.pdf; Mounting: SMT; Package: SOT-323; Part Number: DMG1012UW-7; Price: 0.39; Price Currency: CHF; Supplier 1: Digi-Key; Supplier Part Number 1: DMG1012UW-7DICT-ND; Current Drain: 1A; Pin Count: 3; Temperature Range: -55degC to 150degC; Voltage Drain Source: 20V; Mosfet Type: N-CH
R1-R15 R21 R22 = R_RMCF0805FT330R: R SMT 330R 1% 125mW 2012; Manufacturer: Stackpole Electronics Inc; Temperature Coefficient: 100ppm/degC; Tolerance: +/-1%; Voltage: 150V; Datasheet Url: https://www.seielect.com/catalog/sei-rmcf_rmcp.pdf; Mounting: SMT; Package: 2012; Part Number: RMCF0805FT330R; Price: 0.10; Price Currency: CHF; Supplier 1: Digi-Key; Resistance: 330R; Supplier Part Number 1: RMCF0805FT330RCT-ND; Temperature Range: -55degC to 155degC; Pin Count: 2; Power: 125mW
R16 R17 = R_RMCF0805FT4K70: R SMT 4.7kR 1% 125mW 2012; Manufacturer: Stackpole Electronics Inc; Temperature Coefficient: 100ppm/degC; Tolerance: +/-1%; Voltage: 150V; Datasheet Url: https://www.seielect.com/catalog/sei-rmcf_rmcp.pdf; Mounting: SMT; Package: 2012; Part Number: RMCF0805FT4K70; Price: 0.10; Price Currency: CHF; Supplier 1: Digi-Key; Resistance: 4.7kR; Supplier Part Number 1: RMCF0805FT4K70CT-ND; Temperature Range: -55degC to 155degC; Pin Count: 2; Power: 125mW
R18-R20 = R_RMCF0805FT10K0: R SMT 10kR 1% 125mW 2012; Manufacturer: Stackpole Electronics Inc; Temperature Coefficient: 100ppm/degC; Tolerance: +/-1%; Voltage: 150V; Datasheet Url: https://www.seielect.com/catalog/sei-rmcf_rmcp.pdf; Mounting: SMT; Package: 2012; Part Number: RMCF0805FT10K0; Price: 0.10; Price Currency: CHF; Supplier 1: Digi-Key; Resistance: 10kR; Power: 125mW; Supplier Part Number 1: RMCF0805FT10K0CT-ND; Pin Count: 2; Temperature Range: -55degC to 155degC
R23-R26 = R_RMCF0805FT33R0: R SMT 33R 1% 125mW 2012; Manufacturer: Stackpole Electronics Inc; Temperature Coefficient: 100ppm/degC; Tolerance: +/-1%; Voltage: 150V; Datasheet Url: https://www.seielect.com/catalog/sei-rmcf_rmcp.pdf; Mounting: SMT; Package: 2012; Part Number: RMCF0805FT33R0; Price: 0.10; Price Currency: CHF; Supplier 1: Digi-Key; Resistance: 33R; Supplier Part Number 1: RMCF0805FT33R0CT-ND; Temperature Range: -55degC to 155degC; Pin Count: 2; Power: 125mW
S1 = S_PTS645SL50SMTR92LFS: S TACTILE SPST-NO 12V 50mA SMT; Manufacturer: C&K; Cycles Mechanical: 100000; Datasheet Url: https://dznh3ojzb2azq.cloudfront.net/products/Tactile/PTS645/documents/datasheet.pdf; Mounting: SMT; Package: n/a; Part Number: PTS645SL50SMTR92 LFS; Price: 0.30; Price Currency: CHF; Supplier 1: Digi-Key; Pin Count: 4; Temperature Range: -20degC to 60degC; Supplier Part Number 1: CKN9088CT-ND; Current: 50mA; Cycles Electrical: n/a; Voltage: 12V; Switch Type: SPST-NO
U1 = U_PIC32MZ1024EFE144-I/PH: U MCU 32BIT 1MB 144-TQFP; Manufacturer: Microchip Technology; Bit Count: 32; Voltage Input: 2.1V to 3.6V; Current Output: 5mA; Datasheet Url: https://www.mouser.ch/datasheet/2/268/mchp_s_a0007771640_1-2274641.pdf; Mounting: SMT; Package: 144-TQFP; Part Number: PIC32MZ1024EFE144-I/PH; Price: 13.12; Price Currency: CHF; Supplier 1: Mouser; Pin Count: 144; Supplier Part Number 1: 579-MZ1024EFE144IPH; Temperature Range: -40degC to 85degC; Memory Size: 1MB
Y1 = Y_ECS-327ATQMV-AS-TR: Y OSCILLATOR 32.768kHz CMOS SMT; Manufacturer: ECS Inc.; Current: 200uA; Voltage: 1.62V to 3.63V; Part Number: ECS-327ATQMV-AS-TR; Price Currency: CHF; Datasheet Url: https://ecsxtal.com/store/pdf/ECS-327ATQMV.pdf; Mounting: SMT; Package: n/a; Pin Count: 4; Price: 1.27; Temperature Range: -40degC to 125degC; Frequency: 32.768kHz; Supplier 1: Digi-Key; Supplier Part Number 1: XC2826CT-ND; Technology: CMOS
Y2 = Y_ECS-3225MV-240-CN-TR: Y OSCILLATOR 24MHz HCMOS SMT; Manufacturer: ECS Inc.; Current: 4mA; Voltage: 1.62V to 3.63V; Part Number: ECS-3225MV-240-CN-TR; Price Currency: CHF; Datasheet Url: https://ecsxtal.com/store/pdf/ECS-3225MV.pdf; Mounting: SMT; Package: n/a; Pin Count: 4; Price: 1.20; Temperature Range: -40degC to 85degC; Frequency: 24MHz; Supplier 1: Digi-Key; Supplier Part Number 1: XC2884CT-ND; Technology: HCMOS
Y3 = Y_ECS-3225MV-500-BN-TR: Y OSCILLATOR 50MHz HCMOS SMT; Manufacturer: ECS Inc.; Current: 5mA; Voltage: 1.62V to 3.63V; Part Number: ECS-3225MV-500-BN-TR; Price Currency: CHF; Datasheet Url: https://ecsxtal.com/store/pdf/ECS-3225MV.pdf; Mounting: SMT; Package: n/a; Pin Count: 4; Price: 1.21; Temperature Range: -40degC to 85degC; Frequency: 50MHz; Supplier 1: Digi-Key; Supplier Part Number 1: XC2881CT-ND; Technology: HCMOS

## Sheet PIC32ETH_Ethernet.SchDoc: Ethernet
size A3; Date: 08.01.2022; DrawnBy: YS; DocumentNumber: n/a; Revision: v1.0.0; SheetNumber: 3; SheetTotal: 6; Project: PIC32ETH
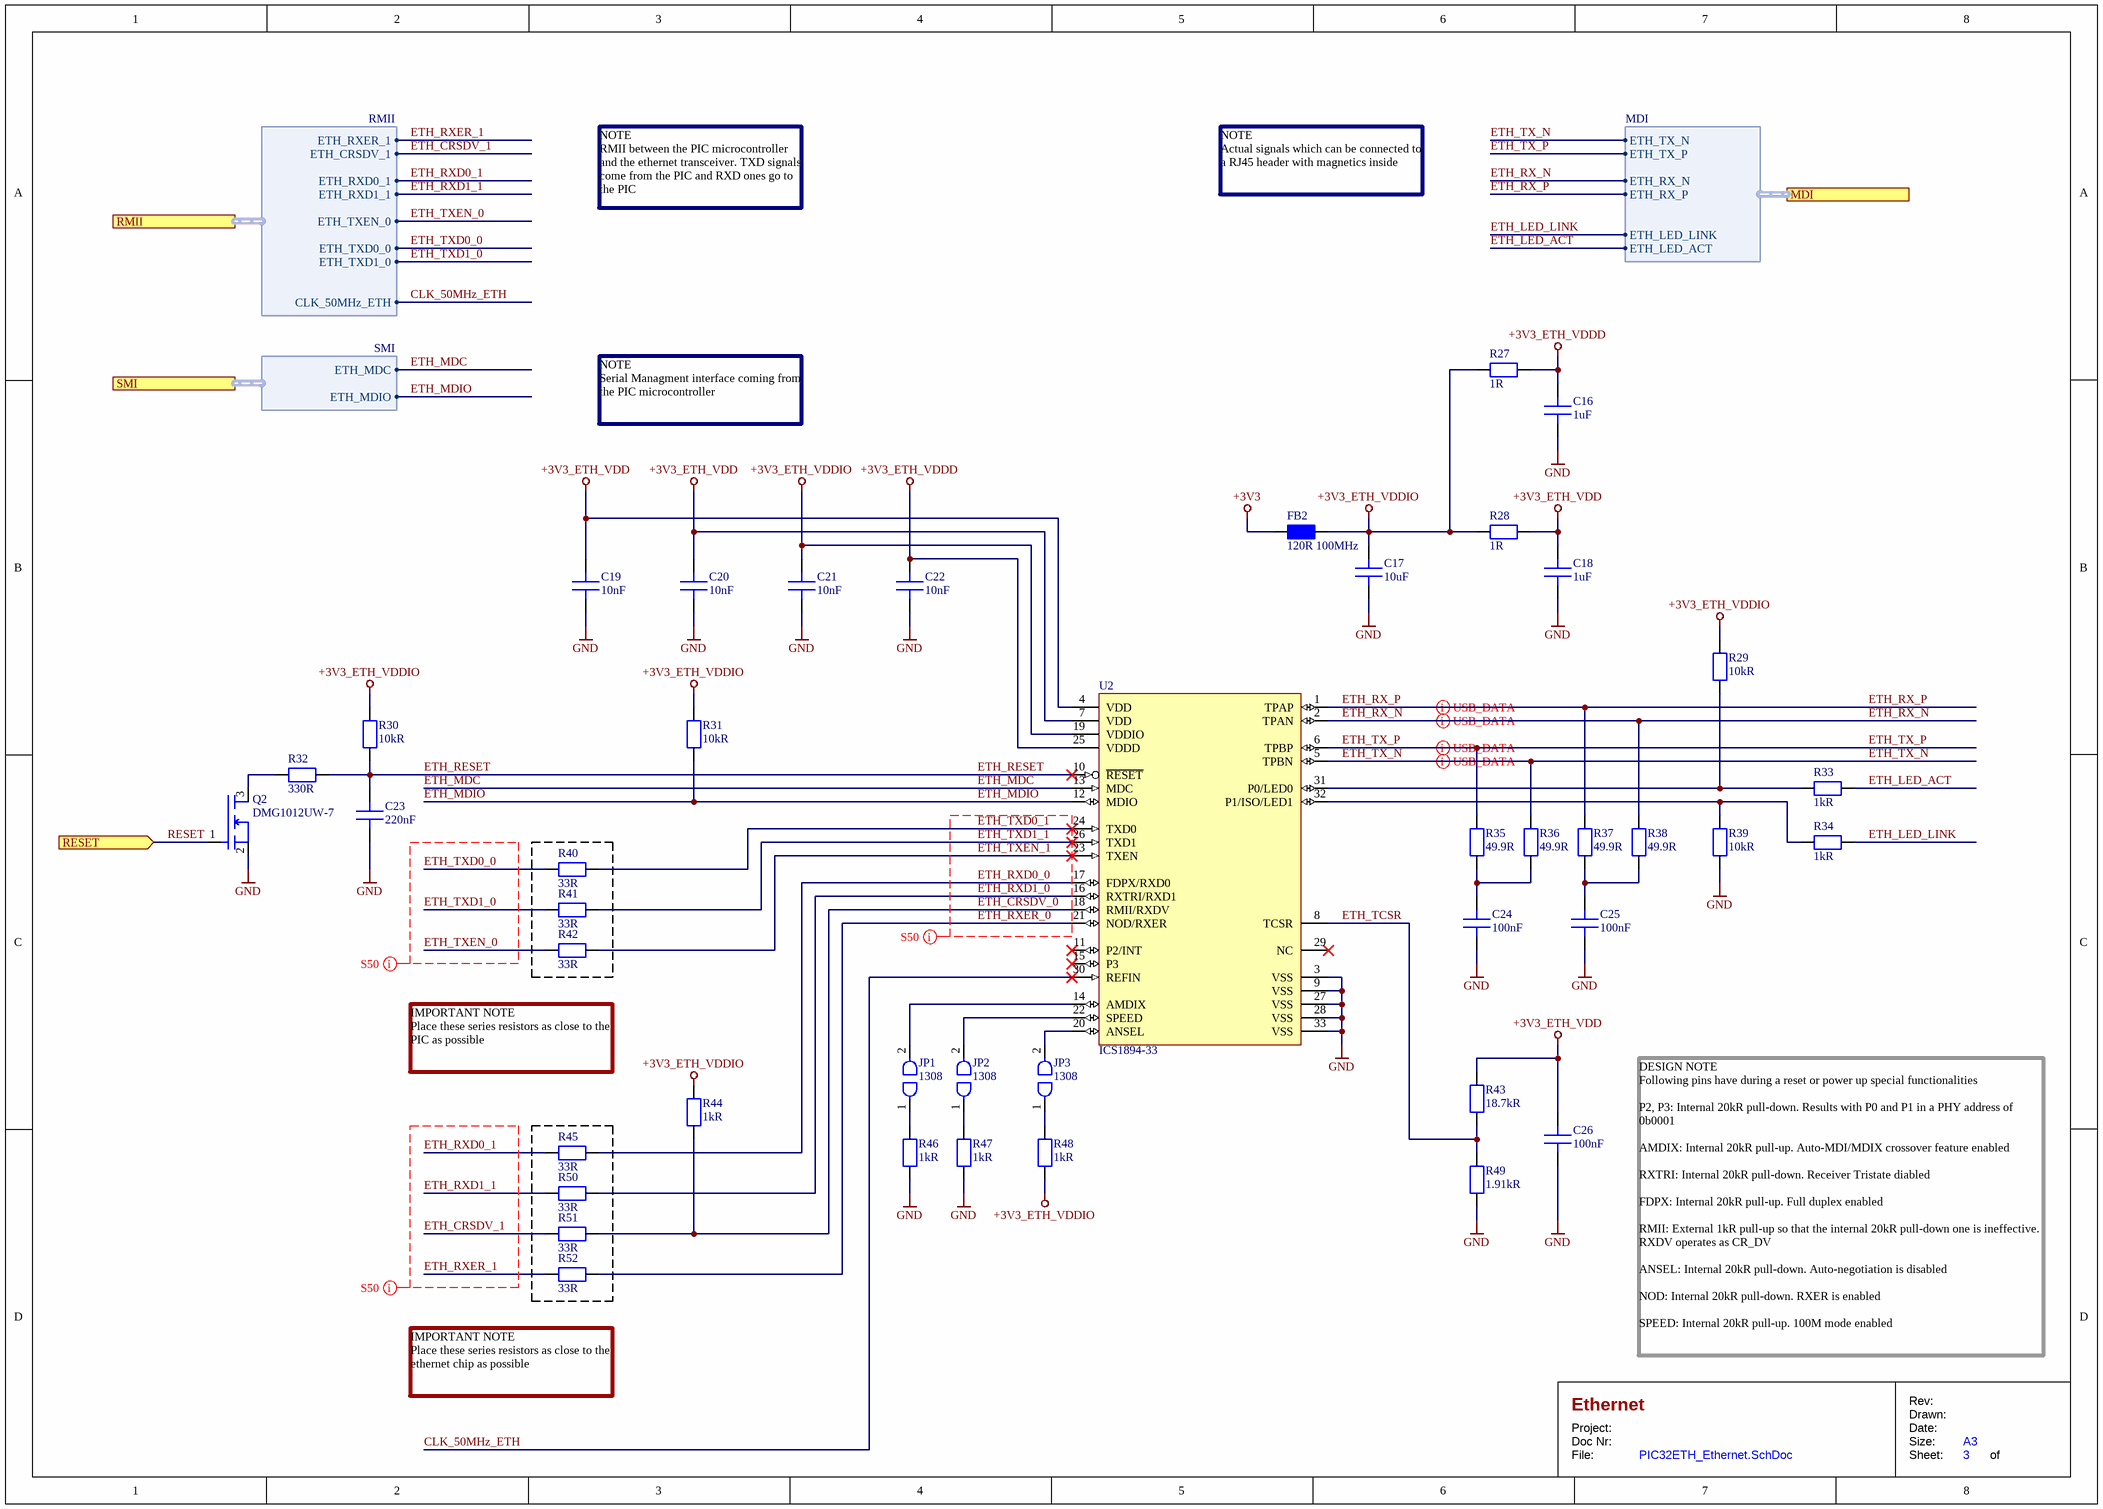
[diagram p3: PIC32ETH_Ethernet.SchDoc]

### Parts
C16  1uF  [C_CHIP2012N]
C17  10uF  [C_CHIP3216N]
C18  1uF  [C_CHIP2012N]
C19  10nF  [C_CHIP2012N]
C20  10nF  [C_CHIP2012N]
C21  10nF  [C_CHIP2012N]
C22  10nF  [C_CHIP2012N]
C23  220nF  [C_CHIP2012N]
C24  100nF  [C_CHIP2012N]
C25  100nF  [C_CHIP2012N]
C26  100nF  [C_CHIP2012N]
FB2  120R 100MHz  [FB_CHIP3216N]
JP1  1308  [JP_SOLDER-2POS-1308]  (no BOM)
JP2  1308  [JP_SOLDER-2POS-1308]  (no BOM)
JP3  1308  [JP_SOLDER-2POS-1308]  (no BOM)
Q2  DMG1012UW-7  [Q_SOT65P210X100-3N]
R27  1R  [R_CHIP2012N]
R28  1R  [R_CHIP2012N]
R29  10kR  [R_CHIP2012N]
R30  10kR  [R_CHIP2012N]
R31  10kR  [R_CHIP2012N]
R32  330R  [R_CHIP2012N]
R33  1kR  [R_CHIP2012N]
R34  1kR  [R_CHIP2012N]
R35  49.9R  [R_CHIP2012N]
R36  49.9R  [R_CHIP2012N]
R37  49.9R  [R_CHIP2012N]
R38  49.9R  [R_CHIP2012N]
R39  10kR  [R_CHIP2012N]
R40  33R  [R_CHIP2012N]
R41  33R  [R_CHIP2012N]
R42  33R  [R_CHIP2012N]
R43  18.7kR  [R_CHIP2012N]
R44  1kR  [R_CHIP2012N]
R45  33R  [R_CHIP2012N]
R46  1kR  [R_CHIP2012N]
R47  1kR  [R_CHIP2012N]
R48  1kR  [R_CHIP2012N]
R49  1.91kR  [R_CHIP2012N]
R50  33R  [R_CHIP2012N]
R51  33R  [R_CHIP2012N]
R52  33R  [R_CHIP2012N]
U2  ICS1894-33  [U_QFN50P500X500X100-HS-33N]

### Ports
MDI (harness MDI), RESET (in), RMII (harness RMII), SMI (harness SMI)

### Harnesses
RMII: CLK_50MHz_ETH, ETH_RXER_1, ETH_TXEN_0, ETH_CRSDV_1, ETH_RXD0_1, ETH_RXD1_1, ETH_TXD1_0, ETH_TXD0_0
MDI: ETH_TX_N, ETH_TX_P, ETH_RX_N, ETH_RX_P, ETH_LED_LINK, ETH_LED_ACT
SMI: ETH_MDIO, ETH_MDC

### Nets
+3V3: FB2.1
+3V3_ETH_VDD: C18.1 C19.2 C20.2 C26.1 R28.2 R43.2 U2.4(VDD) U2.7(VDD)
+3V3_ETH_VDDD: C16.1 C22.2 R27.2 U2.25(VDDD)
+3V3_ETH_VDDIO: C17.2 C21.2 FB2.2 R27.1 R28.1 R29.1 R30.2 R31.2 R44.2 R48.1 U2.19(VDDIO)
GND: C16.2 C17.1 C18.2 C19.1 C20.1 C21.1 C22.1 C23.1 C24.2 C25.2 C26.2 Q2.2(S) R39.1 R46.1 R47.1 R49.1 U2.3(VSS) U2.9(VSS) U2.27(VSS) U2.28(VSS) U2.33(VSS)
CLK_50MHz_ETH: U2.30(REFIN) ; port RMII.CLK_50MHz_ETH
ETH_CRSDV_0: R44.1 R51.2 U2.18(RMII/RXDV)
ETH_CRSDV_1: R51.1 ; port RMII.ETH_CRSDV_1
ETH_LED_ACT: R33.1 ; port MDI.ETH_LED_ACT
ETH_LED_LINK: R34.1 ; port MDI.ETH_LED_LINK
ETH_MDC: U2.13(MDC) ; port SMI.ETH_MDC
ETH_MDIO: R31.1 U2.12(MDIO) ; port SMI.ETH_MDIO
ETH_RESET: C23.2 R30.1 R32.2 U2.10(~{RESET})
ETH_RX_N: R38.2 U2.2(TPAN) ; port MDI.ETH_RX_N
ETH_RX_P: R37.2 U2.1(TPAP) ; port MDI.ETH_RX_P
ETH_RXD0_0: R45.2 U2.17(FDPX/RXD0)
ETH_RXD0_1: R45.1 ; port RMII.ETH_RXD0_1
ETH_RXD1_0: R50.2 U2.16(RXTRI/RXD1)
ETH_RXD1_1: R50.1 ; port RMII.ETH_RXD1_1
ETH_RXER_0: R52.2 U2.21(NOD/RXER)
ETH_RXER_1: R52.1 ; port RMII.ETH_RXER_1
ETH_TCSR: R43.1 R49.2 U2.8(TCSR)
ETH_TX_N: R36.2 U2.5(TPBN) ; port MDI.ETH_TX_N
ETH_TX_P: R35.2 U2.6(TPBP) ; port MDI.ETH_TX_P
ETH_TXD0_0: R40.1 ; port RMII.ETH_TXD0_0
ETH_TXD0_1: R40.2 U2.24(TXD0)
ETH_TXD1_0: R41.1 ; port RMII.ETH_TXD1_0
ETH_TXD1_1: R41.2 U2.26(TXD1)
ETH_TXEN_0: R42.1 ; port RMII.ETH_TXEN_0
ETH_TXEN_1: R42.2 U2.23(TXEN)
RESET: Q2.1(G) ; port RESET
NetC24_1: C24.1 R35.1 R36.1
NetC25_1: C25.1 R37.1 R38.1
NetJP1_1: JP1.1 R46.2
NetJP1_2: JP1.2 U2.14(AMDIX)
NetJP2_1: JP2.1 R47.2
NetJP2_2: JP2.2 U2.22(SPEED)
NetJP3_1: JP3.1 R48.2
NetJP3_2: JP3.2 U2.20(ANSEL)
NetQ2_3: Q2.3(D) R32.1
NetR29_2: R29.2 R33.2 U2.31(P0/LED0)
NetR34_2: R34.2 R39.2 U2.32(P1/ISO/LED1)

Not connected (* = marked no-connect by the designer): U2 11(P2/INT)* 15(P3)* 29(NC)*

### Layout directives
differential pair; differential pair class ETH_TX: ETH_TX_N, ETH_TX_P
differential pair; differential pair class ETH_RX: ETH_RX_N, ETH_RX_P
net class IMPEDANCE_S50: ETH_CRSDV_0, ETH_CRSDV_1, ETH_RXD0_0, ETH_RXD0_1, ETH_RXD1_0, ETH_RXD1_1, ETH_RXER_0, ETH_RXER_1, ETH_TXD0_0, ETH_TXD0_1, ETH_TXD1_0, ETH_TXD1_1, ETH_TXEN_0, ETH_TXEN_1

### Notes on the sheet
- NOTE
  RMII between the PIC microcontroller and the ethernet transceiver. TXD signals come from the PIC and RXD ones go to the PIC
- NOTE
  Actual signals which can be connected to a RJ45 header with magnetics inside
- NOTE
  Serial Managment interface coming from the PIC microcontroller
- IMPORTANT NOTE
  Place these series resistors as close to the PIC as possible
- IMPORTANT NOTE
  Place these series resistors as close to the ethernet chip as possible
- DESIGN NOTE
  Following pins have during a reset or power up special functionalities
  P2, P3: Internal 20kR pull-down. Results with P0 and P1 in a PHY address of 0b0001
  AMDIX: Internal 20kR pull-up. Auto-MDI/MDIX crossover feature enabled
  RXTRI: Internal 20kR pull-down. Receiver Tristate diabled
  FDPX: Internal 20kR pull-up. Full duplex enabled
  RMII: External 1kR pull-up so that the internal 20kR pull-down one is ineffective. RXDV operates as CR_DV
  ANSEL: Internal 20kR pull-down. Auto-negotiation is disabled
  NOD: Internal 20kR pull-down. RXER is enabled
  SPEED: Internal 20kR pull-up. 100M mode enabled
- Project:
- Doc Nr:
- File:
- Drawn:
- Rev:
- Date:
- Size:
- Sheet:
- A3
- of

### Library data of the parts
C16 C18 = C_C0805C105K5RACTU: C CERAMIC 1uF 50V 10% 2012; Manufacturer: Kemet; Dielectric: X7R; Tolerance: +/-10%; Datasheet Url: https://content.kemet.com/datasheets/KEM_C1002_X7R_SMD.pdf; Mounting: SMT; Package: 2012; Part Number: C0805C105K5RACTU; Price: 0.32; Price Currency: CHF; Supplier 1: Digi-Key; Capacitance: 1uF; Voltage: 50V; Supplier Part Number 1: 399-7409-1-ND; Esr: n/a; Pin Count: 2; Temperature Range: -55degC to 125degC
C17 = C_C1206C106K3RACTU: C CERAMIC 10uF 25V 10% 3216; Manufacturer: Kemet; Dielectric: X7R; Tolerance: +/-10%; Package: 3216; Supplier 1: Digi-Key; Part Number: C1206C106K3RACTU; Temperature Range: -55degC to 125degC; Datasheet Url: https://content.kemet.com/datasheets/KEM_C1002_X7R_SMD.pdf; Mounting: SMT; Price: 0.62; Price Currency: CHF; Note: *; Capacitance: 10uF; Voltage: 25V; Pin Count: 2; Esr: n/a; Supplier Part Number 1: 399-7442-1-ND
C19-C22 = C_C0805C103K5RACTU: as C13 on sheet PIC32ETH_Pic; Datasheet Url: https://content.kemet.com/datasheets/KEM_C1002_X7R_SMD.pdf; Mounting: SMT; Package: 2012; Part Number: C0805C103K5RACTU; Price: 0.18; Price Currency: CHF; Supplier 1: Digi-Key; Capacitance: 10nF; Voltage: 50V; Supplier Part Number 1: 399-1158-1-ND; Esr: n/a; Pin Count: 2; Temperature Range: -55degC to 125degC
C23 = C_C0805C224K5RACTU: C CERAMIC 220nF 50V 10% 2012; Manufacturer: Kemet; Dielectric: X7R; Tolerance: +/-10%; Datasheet Url: https://content.kemet.com/datasheets/KEM_C1002_X7R_SMD.pdf; Mounting: SMT; Package: 2012; Part Number: C0805C224K5RACTU; Price: 0.16; Price Currency: CHF; Supplier 1: Digi-Key; Capacitance: 220nF; Voltage: 50V; Supplier Part Number 1: 399-3491-1-ND; Esr: n/a; Pin Count: 2; Temperature Range: -55degC to 125degC
C24-C26 = C_C0805C104K5RACTU: as C49 on sheet PIC32ETH; Datasheet Url: https://content.kemet.com/datasheets/KEM_C1002_X7R_SMD.pdf; Mounting: SMT; Package: 2012; Part Number: C0805C104K5RACTU; Price: 0.23; Price Currency: CHF; Supplier 1: Digi-Key; Capacitance: 100nF; Voltage: 50V; Supplier Part Number 1: 399-1170-1-ND; Esr: n/a; Pin Count: 2; Temperature Range: -55degC to 125degC
FB2 = FB_BLM31KN121SN1L: as FB5 on sheet PIC32ETH; Datasheet Url: https://www.murata.com/en-us/products/productdata/8801529331742/ENFA0091.pdf; Mounting: SMT; Package: 3216; Part Number: BLM31KN121SN1L; Price: 0.29; Price Currency: CHF; Supplier 1: Digi-Key; Supplier Part Number 1: 490-16524-1-ND; Temperature Range: -55degC to 125degC; Pin Count: 2; Current: 6A; Impedance: 120R 100MHz
JP1-JP3 = JP_SOLDER-2POS-1308: JP SOLDER 2POS 1308; Datasheet Url: n/a; Manufacturer: n/a; Mounting: SMT; Package: 1308; Part Number: n/a; Price: n/a; Price Currency: n/a; Supplier 1: n/a; Supplier Part Number 1: n/a; Temperature Range: n/a; Pin Count: 2
Q2 = Q_DMG1012UW-7: as Q1 on sheet PIC32ETH_Pic; Datasheet Url: https://www.diodes.com/assets/Datasheets/ds31859.pdf; Mounting: SMT; Package: SOT-323; Part Number: DMG1012UW-7; Price: 0.39; Price Currency: CHF; Supplier 1: Digi-Key; Supplier Part Number 1: DMG1012UW-7DICT-ND; Current Drain: 1A; Pin Count: 3; Temperature Range: -55degC to 150degC; Voltage Drain Source: 20V; Mosfet Type: N-CH
R27 R28 = R_RMCF0805FT1R00: R SMT 1R 1% 125mW 2012; Manufacturer: Stackpole Electronics Inc; Temperature Coefficient: 100ppm/degC; Tolerance: +/-1%; Voltage: 150V; Datasheet Url: https://www.seielect.com/catalog/sei-rmcf_rmcp.pdf; Mounting: SMT; Package: 2012; Part Number: RMCF0805FT1R00; Price: 0.10; Price Currency: CHF; Supplier 1: Digi-Key; Resistance: 1R; Supplier Part Number 1: RMCF0805FT1R00CT-ND; Temperature Range: -55degC to 155degC; Pin Count: 2; Power: 125mW
R29-R31 R39 = R_RMCF0805FT10K0: as R18 on sheet PIC32ETH_Pic; Datasheet Url: https://www.seielect.com/catalog/sei-rmcf_rmcp.pdf; Mounting: SMT; Package: 2012; Part Number: RMCF0805FT10K0; Price: 0.10; Price Currency: CHF; Supplier 1: Digi-Key; Resistance: 10kR; Power: 125mW; Supplier Part Number 1: RMCF0805FT10K0CT-ND; Pin Count: 2; Temperature Range: -55degC to 155degC
R32 = R_RMCF0805FT330R: as R1 on sheet PIC32ETH_Pic; Datasheet Url: https://www.seielect.com/catalog/sei-rmcf_rmcp.pdf; Mounting: SMT; Package: 2012; Part Number: RMCF0805FT330R; Price: 0.10; Price Currency: CHF; Supplier 1: Digi-Key; Resistance: 330R; Supplier Part Number 1: RMCF0805FT330RCT-ND; Temperature Range: -55degC to 155degC; Pin Count: 2; Power: 125mW
R33 R34 R44 R46-R48 = R_RMCF0805FT1K00: R SMT 1kR 1% 125mW 2012; Manufacturer: Stackpole Electronics Inc; Temperature Coefficient: 100ppm/degC; Tolerance: +/-1%; Voltage: 150V; Datasheet Url: https://www.seielect.com/catalog/sei-rmcf_rmcp.pdf; Mounting: SMT; Package: 2012; Part Number: RMCF0805FT1K00; Price: 0.10; Price Currency: CHF; Supplier 1: Digi-Key; Resistance: 1kR; Supplier Part Number 1: RMCF0805FT1K00CT-ND; Temperature Range: -55degC to 155degC; Pin Count: 2; Power: 125mW
R35-R38 = R_RMCF0805FT49R9: R SMT 49.9R 1% 125mW 2012; Manufacturer: Stackpole Electronics Inc; Temperature Coefficient: 100ppm/degC; Tolerance: +/-1%; Voltage: 150V; Datasheet Url: https://www.seielect.com/catalog/sei-rmcf_rmcp.pdf; Mounting: SMT; Package: 2012; Part Number: RMCF0805FT49R9; Price: 0.10; Price Currency: CHF; Supplier 1: Digi-Key; Resistance: 49.9R; Supplier Part Number 1: RMCF0805FT49R9CT-ND; Temperature Range: -55degC to 155degC; Pin Count: 2; Power: 125mW
R40-R42 R45 R50-R52 = R_RMCF0805FT33R0: as R23 on sheet PIC32ETH_Pic; Datasheet Url: https://www.seielect.com/catalog/sei-rmcf_rmcp.pdf; Mounting: SMT; Package: 2012; Part Number: RMCF0805FT33R0; Price: 0.10; Price Currency: CHF; Supplier 1: Digi-Key; Resistance: 33R; Supplier Part Number 1: RMCF0805FT33R0CT-ND; Temperature Range: -55degC to 155degC; Pin Count: 2; Power: 125mW
R43 = R_RMCF0805FT18K7: R SMT 18.7kR 1% 125mW 2012; Manufacturer: Stackpole Electronics Inc; Temperature Coefficient: 100ppm/degC; Tolerance: +/-1%; Voltage: 150V; Datasheet Url: https://www.seielect.com/catalog/sei-rmcf_rmcp.pdf; Mounting: SMT; Package: 2012; Part Number: RMCF0805FT18K7; Price: 0.10; Price Currency: CHF; Supplier 1: Digi-Key; Resistance: 18.7kR; Power: 125mW; Supplier Part Number 1: RMCF0805FT18K7CT-ND; Pin Count: 2; Temperature Range: -55degC to 155degC
R49 = R_RMCF0805FT1K91: R SMT 1.91kR 1% 125mW 2012; Manufacturer: Stackpole Electronics Inc; Temperature Coefficient: 100ppm/degC; Tolerance: +/-1%; Voltage: 150V; Datasheet Url: https://www.seielect.com/catalog/sei-rmcf_rmcp.pdf; Mounting: SMT; Package: 2012; Part Number: RMCF0805FT1K91; Price: 0.10; Price Currency: CHF; Supplier 1: Digi-Key; Resistance: 1.91kR; Power: 125mW; Supplier Part Number 1: 738-RMCF0805FT1K91CT-ND; Pin Count: 2; Temperature Range: -55degC to 155degC
U2 = U_ICS1894-33: U TRANSCEIVER RMII-ETHERNET 32-QFN; Manufacturer: Renesas; Voltage Input: 3.3V; Datasheet Url: https://www.mouser.ch/datasheet/2/698/REN_1894_33_DST_20120301-1711194.pdf; Mounting: SMT; Package: 32-QFN; Part Number: ICS1894-33; Price: 4.81; Price Currency: CHF; Supplier 1: Mouser; Supplier Part Number 1: 972-1894K-33LF; Temperature Range: 0degC to 70degC; Pin Count: 33; Transceiver Type: RMII-Ethernet

## Sheet PIC32ETH_Peripheral.SchDoc: Peripheral
size A4; Date: 08.01.2022; DrawnBy: YS; DocumentNumber: n/a; Revision: v1.0.0; SheetNumber: 5; SheetTotal: 6; Project: PIC32ETH
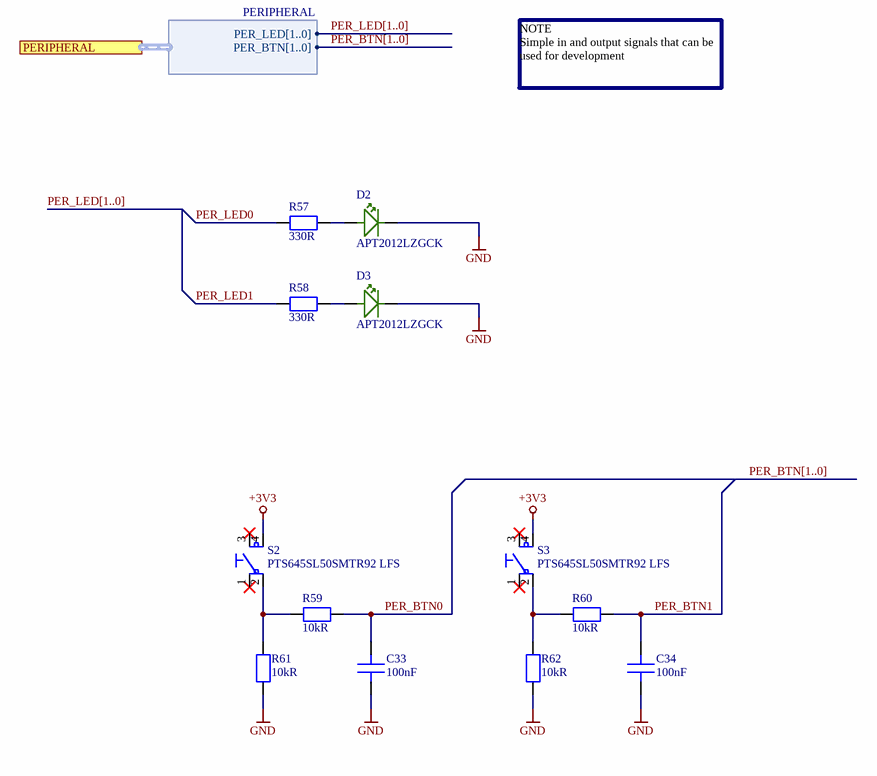
[diagram p4: PIC32ETH_Peripheral.SchDoc]

### Parts
C33  100nF  [C_CHIP2012N]
C34  100nF  [C_CHIP2012N]
D2  APT2012LZGCK  [D_LEDCHIP2012N]
D3  APT2012LZGCK  [D_LEDCHIP2012N]
R57  330R  [R_CHIP2012N]
R58  330R  [R_CHIP2012N]
R59  10kR  [R_CHIP2012N]
R60  10kR  [R_CHIP2012N]
R61  10kR  [R_CHIP2012N]
R62  10kR  [R_CHIP2012N]
S2  PTS645SL50SMTR92 LFS  [S_CHIPP620X620-4N]
S3  PTS645SL50SMTR92 LFS  [S_CHIPP620X620-4N]

### Ports
PERIPHERAL (harness PERIPHERAL)

### Harnesses
PERIPHERAL: PER_BTN[1..0], PER_LED[1..0]

### Nets
+3V3: S2.4 S3.4
GND: C33.2 C34.2 D2.1 D3.1 R61.1 R62.1
PER_BTN0: C33.1 R59.1
PER_BTN1: C34.1 R60.1
PER_LED0: R57.1
PER_LED1: R58.1
NetD2_2: D2.2 R57.2
NetD3_2: D3.2 R58.2
NetR59_2: R59.2 R61.2 S2.2
NetR60_2: R60.2 R62.2 S3.2

Not connected (* = marked no-connect by the designer): S2 1* 3*; S3 1* 3*

### Buses and harness runs
bus PER_BTN[1..0]
bus PER_LED[1..0]

### Notes on the sheet
- NOTE
  Simple in and output signals that can be used for development
- Project:
- Doc Nr:
- File:
- Drawn:
- Rev:
- Date:
- Size:
- Sheet:
- A4
- of

### Library data of the parts
C33 C34 = C_C0805C104K5RACTU: as C49 on sheet PIC32ETH; Datasheet Url: https://content.kemet.com/datasheets/KEM_C1002_X7R_SMD.pdf; Mounting: SMT; Package: 2012; Part Number: C0805C104K5RACTU; Price: 0.23; Price Currency: CHF; Supplier 1: Digi-Key; Capacitance: 100nF; Voltage: 50V; Supplier Part Number 1: 399-1170-1-ND; Esr: n/a; Pin Count: 2; Temperature Range: -55degC to 125degC
D2 D3 = D_APT2012LZGCK: D LED GREEN CLEAR 2.65V 2mA 2012; Manufacturer: Kingbright; Voltage Reverse: 5V; Current Reverse: 50uA; Power: 102.5mW; Datasheet URL: http://www.kingbrightusa.com/images/catalog/SPEC/APT2012LZGCK.pdf; Mounting: SMT; Package: 2012; Part Number: APT2012LZGCK; Price: 0.55; Price Currency: CHF; Supplier 1: Digi-Key; Supplier Part Number 1: 754-1939-1-ND; Temperature Range: -40degC to 85degC; Pin Count: 2; Current Forward: 2mA; Voltage Forward: 2.65V; Color: Green; Lens Transparency: Clear
R57 R58 = R_RMCF0805FT330R: as R1 on sheet PIC32ETH_Pic; Datasheet Url: https://www.seielect.com/catalog/sei-rmcf_rmcp.pdf; Mounting: SMT; Package: 2012; Part Number: RMCF0805FT330R; Price: 0.10; Price Currency: CHF; Supplier 1: Digi-Key; Resistance: 330R; Supplier Part Number 1: RMCF0805FT330RCT-ND; Temperature Range: -55degC to 155degC; Pin Count: 2; Power: 125mW
R59-R62 = R_RMCF0805FT10K0: as R18 on sheet PIC32ETH_Pic; Datasheet Url: https://www.seielect.com/catalog/sei-rmcf_rmcp.pdf; Mounting: SMT; Package: 2012; Part Number: RMCF0805FT10K0; Price: 0.10; Price Currency: CHF; Supplier 1: Digi-Key; Resistance: 10kR; Power: 125mW; Supplier Part Number 1: RMCF0805FT10K0CT-ND; Pin Count: 2; Temperature Range: -55degC to 155degC
S2 S3 = S_PTS645SL50SMTR92LFS: as S1 on sheet PIC32ETH_Pic; Datasheet Url: https://dznh3ojzb2azq.cloudfront.net/products/Tactile/PTS645/documents/datasheet.pdf; Mounting: SMT; Package: n/a; Part Number: PTS645SL50SMTR92 LFS; Price: 0.30; Price Currency: CHF; Supplier 1: Digi-Key; Pin Count: 4; Temperature Range: -20degC to 60degC; Supplier Part Number 1: CKN9088CT-ND; Current: 50mA; Cycles Electrical: n/a; Voltage: 12V; Switch Type: SPST-NO

## Sheet PIC32ETH_Power.SchDoc: Power
size A4; Date: 08.01.2022; DrawnBy: YS; DocumentNumber: n/a; Revision: v1.0.0; SheetNumber: 6; SheetTotal: 6; Project: PIC32ETH
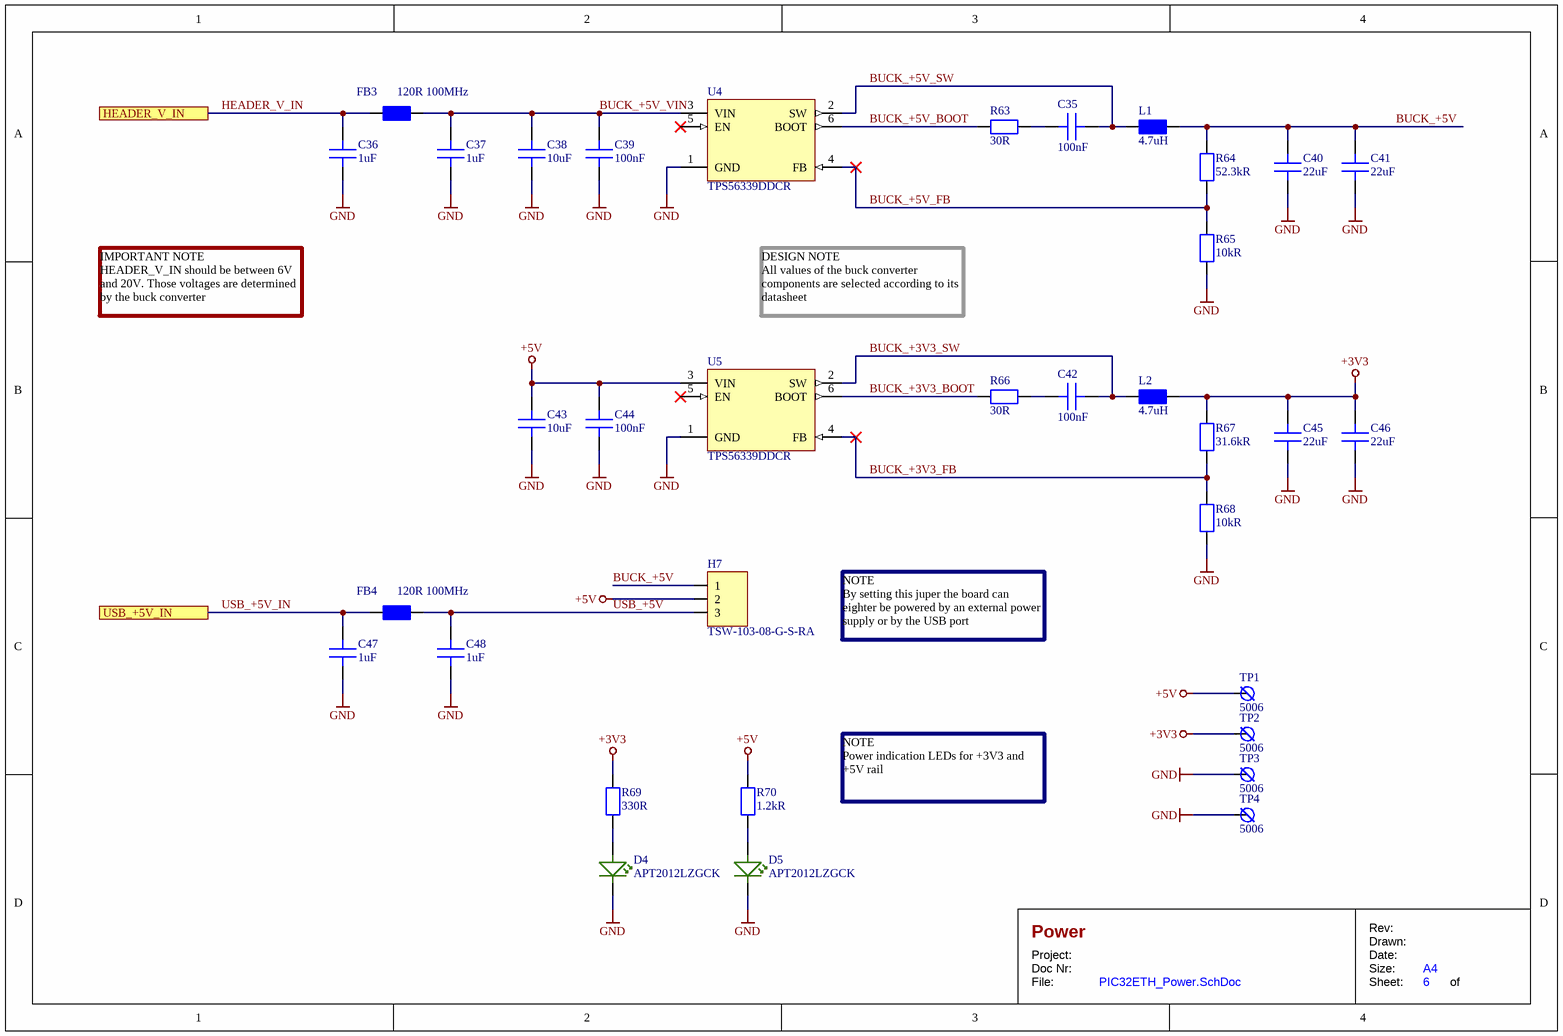
[diagram p5: PIC32ETH_Power.SchDoc]

### Parts
C35  100nF  [C_CHIP2012N]
C36  1uF  [C_CHIP2012N]
C37  1uF  [C_CHIP2012N]
C38  10uF  [C_CHIP3216N]
C39  100nF  [C_CHIP2012N]
C40  22uF  [C_CHIP3216N]
C41  22uF  [C_CHIP3216N]
C42  100nF  [C_CHIP2012N]
C43  10uF  [C_CHIP3216N]
C44  100nF  [C_CHIP2012N]
C45  22uF  [C_CHIP3216N]
C46  22uF  [C_CHIP3216N]
C47  1uF  [C_CHIP2012N]
C48  1uF  [C_CHIP2012N]
D4  APT2012LZGCK  [D_LEDCHIP2012N]
D5  APT2012LZGCK  [D_LEDCHIP2012N]
FB3  120R 100MHz  [FB_CHIP3216N]
FB4  120R 100MHz  [FB_CHIP3216N]
H7  TSW-103-08-G-S-RA  [H_TSW-103-08-G-S-RA]
L1  4.7uH  [L_CHIP2520N]
L2  4.7uH  [L_CHIP2520N]
R63  30R  [R_CHIP2012N]
R64  52.3kR  [R_CHIP2012N]
R65  10kR  [R_CHIP2012N]
R66  30R  [R_CHIP2012N]
R67  31.6kR  [R_CHIP2012N]
R68  10kR  [R_CHIP2012N]
R69  330R  [R_CHIP2012N]
R70  1.2kR  [R_CHIP2012N]
TP1  5006  [TP_5006]
TP2  5006  [TP_5006]
TP3  5006  [TP_5006]
TP4  5006  [TP_5006]
U4  TPS56339DDCR  [U_SOT95P280X145-6N]
U5  TPS56339DDCR  [U_SOT95P280X145-6N]

### Ports
HEADER_V_IN, USB_+5V_IN

### Nets
+3V3: C45.2 C46.2 L2.2 R67.2 R69.2 TP2.1(A)
+5V: C43.2 C44.2 H7.2 R70.2 TP1.1(A) U5.3(VIN)
GND: C36.1 C37.1 C38.1 C39.1 C40.1 C41.1 C43.1 C44.1 C45.1 C46.1 C47.1 C48.1 D4.1 D5.1 R65.1 R68.1 TP3.1(A) TP4.1(A) U4.1(GND) U5.1(GND)
BUCK_+3V3_BOOT: R66.1 U5.6(BOOT)
BUCK_+3V3_FB: R67.1 R68.2 U5.4(FB)
BUCK_+3V3_SW: C42.1 L2.1 U5.2(SW)
BUCK_+5V: C40.2 C41.2 H7.1 L1.2 R64.2
BUCK_+5V_BOOT: R63.1 U4.6(BOOT)
BUCK_+5V_FB: R64.1 R65.2 U4.4(FB)
BUCK_+5V_SW: C35.1 L1.1 U4.2(SW)
BUCK_+5V_VIN: C37.2 C38.2 C39.2 FB3.2 U4.3(VIN)
HEADER_V_IN: C36.2 FB3.1 ; port HEADER_V_IN
USB_+5V: C48.2 FB4.2 H7.3
USB_+5V_IN: C47.2 FB4.1 ; port USB_+5V_IN
NetC35_2: C35.2 R63.2
NetC42_2: C42.2 R66.2
NetD4_2: D4.2 R69.1
NetD5_2: D5.2 R70.1

Not connected (* = marked no-connect by the designer): U4 5(EN)*; U5 5(EN)*

### Notes on the sheet
- IMPORTANT NOTE
  HEADER_V_IN should be between 6V and 20V. Those voltages are determined by the buck converter
- DESIGN NOTE
  All values of the buck converter components are selected according to its datasheet
- NOTE
  By setting this juper the board can eighter be powered by an external power supply or by the USB port
- NOTE
  Power indication LEDs for +3V3 and +5V rail
- Project:
- Doc Nr:
- File:
- Drawn:
- Rev:
- Date:
- Size:
- Sheet:
- A4
- of

### Library data of the parts
C35 C39 C42 C44 = C_C0805C104K5RACTU: as C49 on sheet PIC32ETH; Datasheet Url: https://content.kemet.com/datasheets/KEM_C1002_X7R_SMD.pdf; Mounting: SMT; Package: 2012; Part Number: C0805C104K5RACTU; Price: 0.23; Price Currency: CHF; Supplier 1: Digi-Key; Capacitance: 100nF; Voltage: 50V; Supplier Part Number 1: 399-1170-1-ND; Esr: n/a; Pin Count: 2; Temperature Range: -55degC to 125degC
C36 C37 C47 C48 = C_C0805C105K5RACTU: as C16 on sheet PIC32ETH_Ethernet; Datasheet Url: https://content.kemet.com/datasheets/KEM_C1002_X7R_SMD.pdf; Mounting: SMT; Package: 2012; Part Number: C0805C105K5RACTU; Price: 0.32; Price Currency: CHF; Supplier 1: Digi-Key; Capacitance: 1uF; Voltage: 50V; Supplier Part Number 1: 399-7409-1-ND; Esr: n/a; Pin Count: 2; Temperature Range: -55degC to 125degC
C38 C43 = C_C1206C106K3RACTU: as C17 on sheet PIC32ETH_Ethernet; Package: 3216; Supplier 1: Digi-Key; Part Number: C1206C106K3RACTU; Temperature Range: -55degC to 125degC; Datasheet Url: https://content.kemet.com/datasheets/KEM_C1002_X7R_SMD.pdf; Mounting: SMT; Price: 0.62; Price Currency: CHF; Note: *; Capacitance: 10uF; Voltage: 25V; Pin Count: 2; Esr: n/a; Supplier Part Number 1: 399-7442-1-ND
C40 C41 C45 C46 = C_C1206C226K8RAC7800: as C50 on sheet PIC32ETH; Package: 3216; Supplier 1: Digi-Key; Part Number: C1206C226K8RAC7800; Temperature Range: -55degC to 125degC; Datasheet Url: https://api.kemet.com/component-edge/download/datasheet/C1206C226K8RAC7800.pdf; Mounting: SMT; Price: 0.65; Price Currency: CHF; Note: *; Capacitance: 22uF; Voltage: 10V; Pin Count: 2; Esr: n/a; Supplier Part Number 1: 399-11947-1-ND
D4 D5 = D_APT2012LZGCK: as D2 on sheet PIC32ETH_Peripheral; Datasheet URL: http://www.kingbrightusa.com/images/catalog/SPEC/APT2012LZGCK.pdf; Mounting: SMT; Package: 2012; Part Number: APT2012LZGCK; Price: 0.55; Price Currency: CHF; Supplier 1: Digi-Key; Supplier Part Number 1: 754-1939-1-ND; Temperature Range: -40degC to 85degC; Pin Count: 2; Current Forward: 2mA; Voltage Forward: 2.65V; Color: Green; Lens Transparency: Clear
FB3 FB4 = FB_BLM31KN121SN1L: as FB5 on sheet PIC32ETH; Datasheet Url: https://www.murata.com/en-us/products/productdata/8801529331742/ENFA0091.pdf; Mounting: SMT; Package: 3216; Part Number: BLM31KN121SN1L; Price: 0.29; Price Currency: CHF; Supplier 1: Digi-Key; Supplier Part Number 1: 490-16524-1-ND; Temperature Range: -55degC to 125degC; Pin Count: 2; Current: 6A; Impedance: 120R 100MHz
H7 = H_TSW-103-08-G-S-RA: H GENERAL HEADER 3POS 1ROW 2.54mm ANGLE THT; Manufacturer: Samtec Inc.; Current: 5.7A; Voltage: 550VAC, 770VDC; Positions: 3; Rows: 1; Datasheet URL: http://suddendocs.samtec.com/catalog_english/tsw_th.pdf; Mounting: THT; Package: n/a; Part Number: TSW-103-08-G-S-RA; Price: 0.40; Price Currency: CHF; Supplier 1: Digi-Key; Supplier Part Number 1: SAM1039-03-ND; Temperature Range: -55degC to 125degC; Pin Count: 3; Mating Cycles: n/a; Header Type: Header; Orientation: Angle; Spacing: 2.54mm
L1 L2 = L_LQM2HPN4R7MG0L: L CERAMIC 4.7uH 1.1A 138mR 2520; Manufacturer: Murata Electronics; Tolerance: +/-20%; Datasheet Url: https://search.murata.co.jp/Ceramy/image/img/P02/JELF243B-0019.pdf; Mounting: SMT; Package: 2520; Part Number: LQM2HPN4R7MG0L; Price: 0.28; Price Currency: CHF; Supplier 1: Digi-Key; Inductance: 4.7uH; Voltage: n/a; Supplier Part Number 1: 490-5116-1-ND; Pin Count: 2; Temperature Range: -55degC to 125degC; Current: 1.1A; Resistance: 138mR
R63 R66 = R_RMCF0805FT30R0: R SMT 30R 1% 125mW 2012; Manufacturer: Stackpole Electronics Inc; Temperature Coefficient: 100ppm/degC; Tolerance: +/-1%; Voltage: 150V; Datasheet Url: https://www.seielect.com/catalog/sei-rmcf_rmcp.pdf; Mounting: SMT; Package: 2012; Part Number: RMCF0805FT30R0; Price: 0.10; Price Currency: CHF; Supplier 1: Digi-Key; Resistance: 30R; Supplier Part Number 1: RMCF0805FT30R0CT-ND; Temperature Range: -55degC to 155degC; Pin Count: 2; Power: 125mW
R64 = R_RMCF0805FT52K3: R SMT 52.3kR 1% 125mW 2012; Manufacturer: Stackpole Electronics Inc; Temperature Coefficient: 100ppm/degC; Tolerance: +/-1%; Voltage: 150V; Datasheet Url: https://www.seielect.com/catalog/sei-rmcf_rmcp.pdf; Mounting: SMT; Package: 2012; Part Number: RMCF0805FT52K3; Price: 0.10; Price Currency: CHF; Supplier 1: Digi-Key; Resistance: 52.3kR; Supplier Part Number 1: RMCF0805FT52K3CT-ND; Temperature Range: -55degC to 155degC; Pin Count: 2; Power: 125mW
R65 R68 = R_RMCF0805FT10K0: as R18 on sheet PIC32ETH_Pic; Datasheet Url: https://www.seielect.com/catalog/sei-rmcf_rmcp.pdf; Mounting: SMT; Package: 2012; Part Number: RMCF0805FT10K0; Price: 0.10; Price Currency: CHF; Supplier 1: Digi-Key; Resistance: 10kR; Power: 125mW; Supplier Part Number 1: RMCF0805FT10K0CT-ND; Pin Count: 2; Temperature Range: -55degC to 155degC
R67 = R_RMCF0805FT31K6: R SMT 31.6kR 1% 125mW 2012; Manufacturer: Stackpole Electronics Inc; Temperature Coefficient: 100ppm/degC; Tolerance: +/-1%; Voltage: 150V; Datasheet Url: https://www.seielect.com/catalog/sei-rmcf_rmcp.pdf; Mounting: SMT; Package: 2012; Part Number: RMCF0805FT31K6; Price: 0.10; Price Currency: CHF; Supplier 1: Digi-Key; Resistance: 31.6kR; Supplier Part Number 1: RMCF0805FT31K6CT-ND; Temperature Range: -55degC to 155degC; Pin Count: 2; Power: 125mW
R69 = R_RMCF0805FT330R: as R1 on sheet PIC32ETH_Pic; Datasheet Url: https://www.seielect.com/catalog/sei-rmcf_rmcp.pdf; Mounting: SMT; Package: 2012; Part Number: RMCF0805FT330R; Price: 0.10; Price Currency: CHF; Supplier 1: Digi-Key; Resistance: 330R; Supplier Part Number 1: RMCF0805FT330RCT-ND; Temperature Range: -55degC to 155degC; Pin Count: 2; Power: 125mW
R70 = R_RMCF0805FT1K20: R SMT 1.2kR 1% 125mW 2012; Manufacturer: Stackpole Electronics Inc; Temperature Coefficient: 100ppm/degC; Tolerance: +/-1%; Voltage: 150V; Datasheet Url: https://www.seielect.com/catalog/sei-rmcf_rmcp.pdf; Mounting: SMT; Package: 2012; Part Number: RMCF0805FT1K20; Price: 0.10; Price Currency: CHF; Supplier 1: Digi-Key; Resistance: 1.2kR; Supplier Part Number 1: RMCF0805FT1K20CT-ND; Temperature Range: -55degC to 155degC; Pin Count: 2; Power: 125mW
TP1-TP4 = TP_5006: TP COMPACT BLACK THT; Manufacturer: Keystone Electronics; Datasheet Url: https://www.keyelco.com/userAssets/file/M65p56.pdf; Mounting: THT; Package: n/a; Part Number: 5006; Price: 0.35; Price Currency: CHF; Supplier 1: Digi-Key; Current: n/a; Pin Count: 1; Temperature Range: n/a; Supplier Part Number 1: 36-5006-ND; Voltage: n/a; Color: Black
U4 U5 = U_TPS56339DDCR: U REGULATOR BUCK 0.8V TO 16V 3A SOT-23-6; Manufacturer: Texas Instruments; Voltage Input: 4.5V to 24V; Datasheet Url: https://www.ti.com/lit/ds/symlink/tps56339.pdf?ts=1604352153609&ref_url=https%253A%252F%252Fwww.ti.com%252Fproduct%252FTPS56339%253FkeyMatch%253DTPS56%2526tisearch%253DSearch-EN-everything%2526usecase%253DGPN; Mounting: SMT; Package: SOT-23-6; Part Number: TPS56339DDCR; Price: 1.14; Price Currency: CHF; Supplier 1: Digi-Key; Pin Count: 6; Supplier Part Number 1: 296-53568-1-ND; Temperature Range: -40degC to 125degC; Current Output: 3A; Regulator Type: Buck; Voltage Output: 0.8V to 16V